# Altium project Hydra A1 UCLO 35131D.PrjPCB (part 13 of 14)

## Sheet 9.6 GHz LO Driver.SchDoc: 9.6 GHz LO Driver
size D; DrawnBy: C. Lewis; Engineer: C. Lewis; Address1: 4650 NORRIS CANYON RD.; Address2: SAN RAMON, CA 94583; DocumentNumber: 35133; Revision: D; SheetNumber: 16; SheetTotal: 20
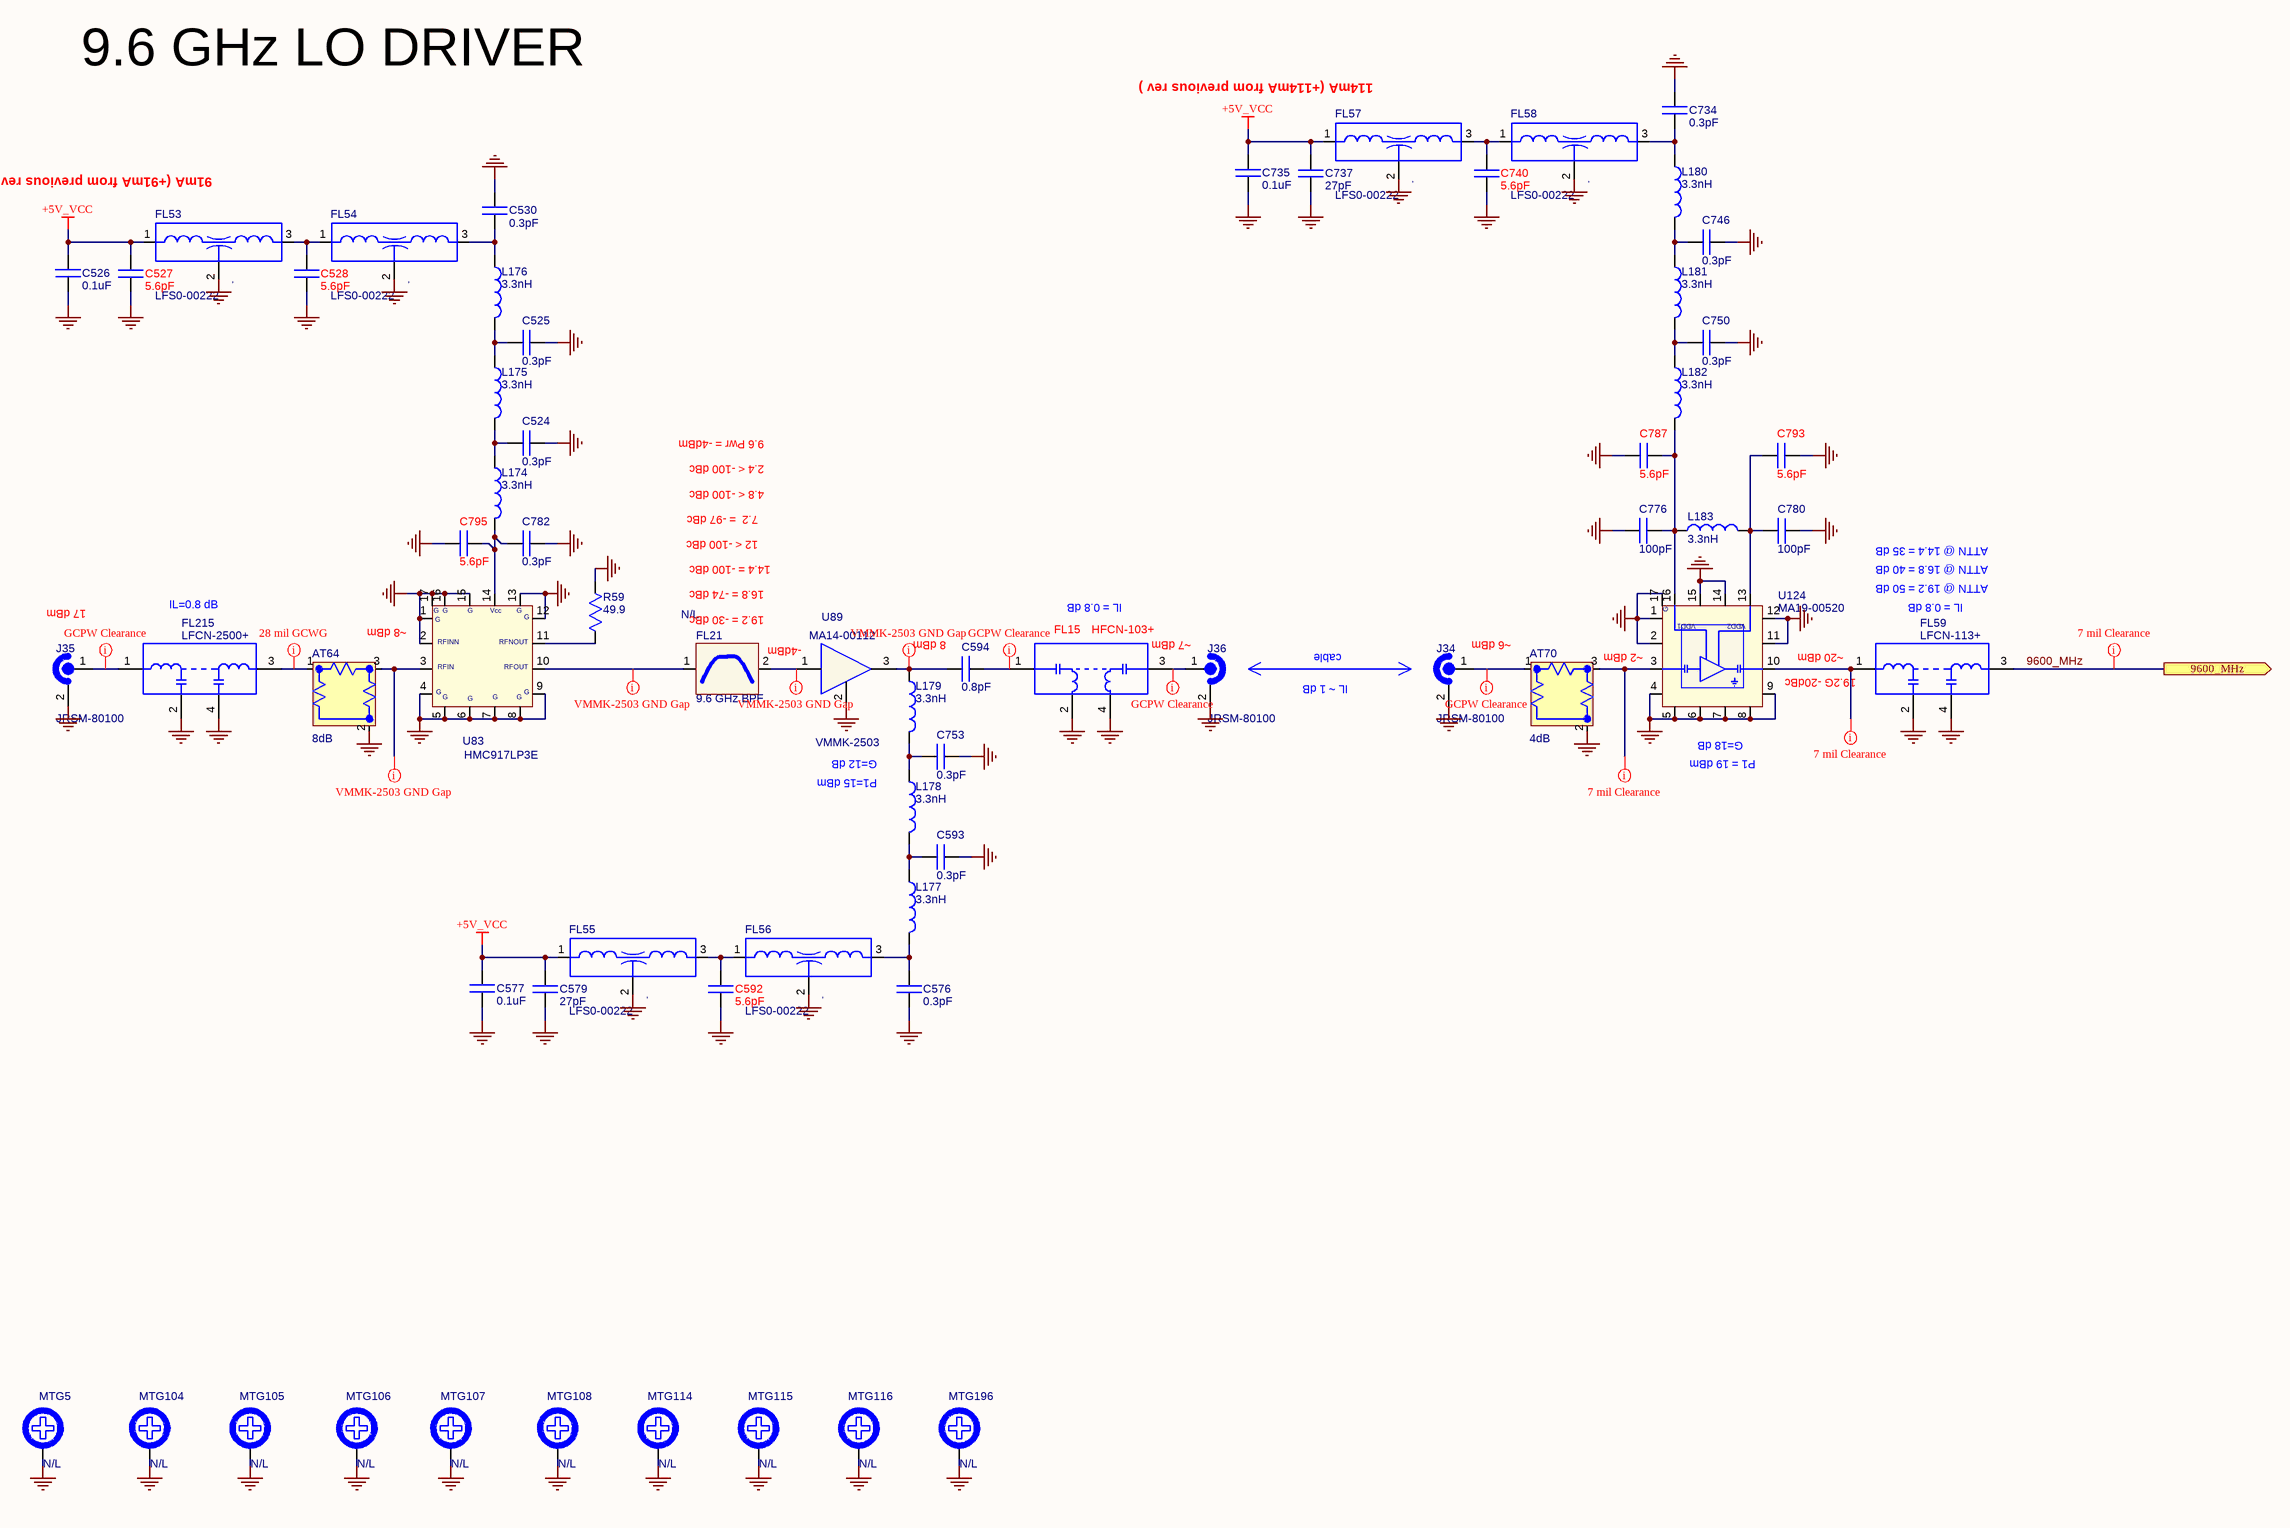
[diagram p65: 9.6 GHz LO Driver.SchDoc]

### Parts
(Parts that share a designator on the sheet are numbered #1, #2 ... from top to bottom, then left to right.)
AT64  value 8dB  [ATTN-IMS-0805]  (hidden comment: PAD;CHIP;8dB;+/-.3dB;.08 x .05;50 OHM;FACE DOWN)
AT70  value 4dB  [ATTN-IMS-0805]  (hidden comment: PAD;CHIP;4dB;+/-.3dB;.08 x .05;50 OHM;FACE DOWN)
C524  value 0.3pF  [CAP-0402-RF]  (hidden comment: .3 PF 200V .05PF HIGH Q SMT 0402)
C525  value 0.3pF  [CAP-0402-RF]  (hidden comment: .3 PF 200V .05PF HIGH Q SMT 0402)
C526  value 0.1uF  [CAP-0402-N]  (hidden comment: .1 UF,10%;X7R;16V,CHIP;0402)
C527  value 5.6pF  [CAP-0402-N]  (hidden comment: 5.6 PF;200V;.1PF;HIGH Q;SMT;CERAMIC;0402)
C528  value 5.6pF  [CAP-0402-N]  (hidden comment: 5.6 PF;200V;.1PF;HIGH Q;SMT;CERAMIC;0402)
C530  value 0.3pF  [CAP-0402-RF]  (hidden comment: .3 PF 200V .05PF HIGH Q SMT 0402)
C576  value 0.3pF  [CAP-0402-RF]  (hidden comment: .3 PF 200V .05PF HIGH Q SMT 0402)
C577  value 0.1uF  [CAP-0402-N]  (hidden comment: .1 UF,10%;X7R;16V,CHIP;0402)
C579  value 27pF  [CAP-0402-N]  (hidden comment: 27 PF;5%;COG;>50V;CHIP;0402)
C592  value 5.6pF  [CAP-0402-N]  (hidden comment: 5.6 PF;200V;.1PF;HIGH Q;SMT;CERAMIC;0402)
C593  value 0.3pF  [CAP-0402-RF]  (hidden comment: .3 PF 200V .05PF HIGH Q SMT 0402)
C594  value 0.8pF  [CAP-0402-RF]  (hidden comment: .8 PF;200V;.05PF;HIGH Q;SMT;CERAMIC;0402)
C734  value 0.3pF  [CAP-0402-RF]  (hidden comment: .3 PF 200V .05PF HIGH Q SMT 0402)
C735  value 0.1uF  [CAP-0402-N]  (hidden comment: .1 UF,10%;X7R;16V,CHIP;0402)
C737  value 27pF  [CAP-0402-N]  (hidden comment: 27 PF;5%;COG;>50V;CHIP;0402)
C740  value 5.6pF  [CAP-0402-N]  (hidden comment: 5.6 PF;200V;.1PF;HIGH Q;SMT;CERAMIC;0402)
C746  value 0.3pF  [CAP-0402-RF]  (hidden comment: .3 PF 200V .05PF HIGH Q SMT 0402)
C750  value 0.3pF  [CAP-0402-RF]  (hidden comment: .3 PF 200V .05PF HIGH Q SMT 0402)
C753  value 0.3pF  [CAP-0402-RF]  (hidden comment: .3 PF 200V .05PF HIGH Q SMT 0402)
C776  value 100pF  [CAP-0402-N]  (hidden comment: 100 PF;5%;COG;>50V;CHIP;0402)
C780  value 100pF  [CAP-0402-N]  (hidden comment: 100 PF;5%;COG;>50V;CHIP;0402)
C782  value 0.3pF  [CAP-0402-RF]  (hidden comment: .3 PF 200V .05PF HIGH Q SMT 0402)
C787  value 5.6pF  [CAP-0402-N]  (hidden comment: 5.6 PF;200V;.1PF;HIGH Q;SMT;CERAMIC;0402)
C793  value 5.6pF  [CAP-0402-N]  (hidden comment: 5.6 PF;200V;.1PF;HIGH Q;SMT;CERAMIC;0402)
C795  value 5.6pF  [CAP-0402-N]  (hidden comment: 5.6 PF;200V;.1PF;HIGH Q;SMT;CERAMIC;0402)
FL15  M_PN: HFCN-103+  [FV1206-4]  (hidden comment: FILTER;HI PASS;9700MHz;7SEC;FV1206-4;RoHS)
FL21  value 9.6 GHz BPF  NoLoad: N/L  [9.6_GHz_BPF]  (hidden comment: .)
FL53  Filter EMI 2200PF,1206  [FIL-NFE31P-1206-4P]  (value not drawn)
FL54  Filter EMI 2200PF,1206  [FIL-NFE31P-1206-4P]  (value not drawn)
FL55  Filter EMI 2200PF,1206  [FIL-NFE31P-1206-4P]  (value not drawn)
FL56  Filter EMI 2200PF,1206  [FIL-NFE31P-1206-4P]  (value not drawn)
FL57  Filter EMI 2200PF,1206  [FIL-NFE31P-1206-4P]  (value not drawn)
FL58  Filter EMI 2200PF,1206  [FIL-NFE31P-1206-4P]  (value not drawn)
FL59  M_PN: LFCN-113+  [FV1206-4]  (hidden comment: TER;LOW PASS;11.000GHZ;7 SECTIONS;.5A;FV1206-4)
FL215  M_PN: LFCN-2500+  [FV1206]  (hidden comment: FILTER;LOW PASS;2.500GHZ;5 SECTIONS;1A;1206)
J34  SMPM;FD;MALE;STRAIGHT;SMT;.152X.152X.150;PCB;R/A CONTACT  [JRSM-80100]  (value not drawn)
J35  SMPM;FD;MALE;STRAIGHT;SMT;.152X.152X.150;PCB;R/A CONTACT  [JRSM-80100]  (value not drawn)
J36  SMPM;FD;MALE;STRAIGHT;SMT;.152X.152X.150;PCB;R/A CONTACT  [JRSM-80100]  (value not drawn)
L174  value 3.3nH  [IND-0402HP]  (hidden comment: INDUCTOR;3.3NH;2%;12.8G SRF;95Q @1.7G;.045DCR;1.7A;0402)
L175  value 3.3nH  [IND-0402HP]  (hidden comment: INDUCTOR;3.3NH;2%;12.8G SRF;95Q @1.7G;.045DCR;1.7A;0402)
L176  value 3.3nH  [IND-0402HP]  (hidden comment: INDUCTOR;3.3NH;2%;12.8G SRF;95Q @1.7G;.045DCR;1.7A;0402)
L177  value 3.3nH  [IND-0402HP]  (hidden comment: INDUCTOR;3.3NH;2%;12.8G SRF;95Q @1.7G;.045DCR;1.7A;0402)
L178  value 3.3nH  [IND-0402HP]  (hidden comment: INDUCTOR;3.3NH;2%;12.8G SRF;95Q @1.7G;.045DCR;1.7A;0402)
L179  value 3.3nH  [IND-0402HP]  (hidden comment: INDUCTOR;3.3NH;2%;12.8G SRF;95Q @1.7G;.045DCR;1.7A;0402)
L180  value 3.3nH  [IND-0402HP]  (hidden comment: INDUCTOR;3.3NH;2%;12.8G SRF;95Q @1.7G;.045DCR;1.7A;0402)
L181  value 3.3nH  [IND-0402HP]  (hidden comment: INDUCTOR;3.3NH;2%;12.8G SRF;95Q @1.7G;.045DCR;1.7A;0402)
L182  value 3.3nH  [IND-0402HP]  (hidden comment: INDUCTOR;3.3NH;2%;12.8G SRF;95Q @1.7G;.045DCR;1.7A;0402)
L183  value 3.3nH  [IND-0402HP]  (hidden comment: INDUCTOR;3.3NH;2%;12.8G SRF;95Q @1.7G;.045DCR;1.7A;0402)
MTG5  NoLoad: N/L  [MHP200X92]
MTG104#2  NoLoad: N/L  [MHP200X92]
MTG105  NoLoad: N/L  [MHP200X92]
MTG106  NoLoad: N/L  [MHP200X92]
MTG107  NoLoad: N/L  [MHP200X92]
MTG108  NoLoad: N/L  [MHP200X92]
MTG114  NoLoad: N/L  [MHP200X92]
MTG115  NoLoad: N/L  [MHP200X92]
MTG116  NoLoad: N/L  [MHP200X92]
MTG196  NoLoad: N/L  [MHP200X92]
R59  value 49.9  [RES-0201-N]  (hidden comment: 49.9 OHMS;.05W;1%;200PPM;FILM CHIP;0201)
U83  M_PN: HMC917LP3E  [QFN-16_HITTITE_LP3]  (hidden comment: QUADRUPLER;1500-2500 MHZ IN;5DB CONV LOSS;0-10DBM IN;LP3E)
U89  M_PN: VMMK-2503  [AMP-VMMK-2503]  (hidden comment: AMP;1-12GHz;13.5dB;+17dBm;5V;68mA;WLP-0402)
U124  AMP;5-11GHz;21dB;+19dBm;5V;114mA;LC3  [QFN-16_HITTITE_LC3_036]  (value not drawn)

### Ports
9600_MHz

### Nets
+5V_VCC: C526.1 C527.2 C577.1 C579.2 C735.1 C737.2 FL53.1(IN) FL55.1(IN) FL57.1(IN)
GND: AT64.2(GND) AT70.2(GND) C524.1 C525.1 C526.2 C527.1 C528.1 C530.1 C576.1 C577.2 C579.1 C592.1 C593.1 C734.1 C735.2 C737.1 C740.1 C746.1 C750.1 C753.1 C776.1 C780.1 C782.1 C787.2 C793.2 C795.2 FL15.2(GND) FL15.4(GND) FL53.2(GND) FL54.2(GND) FL55.2(GND) FL56.2(GND) FL57.2(GND) FL58.2(GND) FL59.2(GND) FL59.4(GND) FL215.2(GND) FL215.4(GND) J34.2(GND) J35.2(GND) J36.2(GND) MTG5.MH MTG104#2.MH MTG105.MH MTG106.MH MTG107.MH MTG108.MH MTG114.MH MTG115.MH MTG116.MH MTG196.MH R59.2 U83.1(Vdd) U83.2(Vctl) U83.4(NC) U83.5(EN) U83.6(NC) U83.7(NC) U83.8(NC) U83.9(RF1) U83.12(RF2) U83.13(NC) U83.15(NC) U83.16(NC) U83.17(GND) U89.2(GND) U124.1(NC) U124.2(NC) U124.4(NC) U124.5(NC) U124.6(NC) U124.7(NC) U124.8(NC) U124.9(NC) U124.11(NC) U124.12(NC) U124.14(NC) U124.15(NC) U124.17(GND)
9600_MHz: FL59.3(OUT) ; port 9600_MHz
NetAT64_1: AT64.1(IN/OUT) FL215.3(OUT)
NetAT64_3: AT64.3(IN/OUT) U83.3(RFC)
NetAT70_1: AT70.1(IN/OUT) J34.1(CNTR)
NetAT70_3: AT70.3(IN/OUT) U124.3(RF_IN)
NetC524_2: C524.2 L174.2 L175.1
NetC525_2: C525.2 L175.2 L176.1
NetC528_2: C528.2 FL53.3(OUT) FL54.1(IN)
NetC530_2: C530.2 FL54.3(OUT) L176.2
NetC576_2: C576.2 FL56.3(OUT) L177.2
NetC592_2: C592.2 FL55.3(OUT) FL56.1(IN)
NetC593_2: C593.2 L177.1 L178.2
NetC594_1: C594.1 FL15.1(IN)
NetC594_2: C594.2 L179.1 U89.3(OUT)
NetC734_2: C734.2 FL58.3(OUT) L180.2
NetC740_2: C740.2 FL57.3(OUT) FL58.1(IN)
NetC746_2: C746.2 L180.1 L181.2
NetC750_2: C750.2 L181.1 L182.2
NetC753_2: C753.2 L178.1 L179.2
NetC776_2: C776.2 C787.1 L182.1 L183.2 U124.16(VDD1)
NetC780_2: C780.2 C793.1 L183.1 U124.13(VDD2)
NetC782_2: C782.2 C795.1 L174.1 U83.14(NC)
NetFL15_3: FL15.3(OUT) J36.1(CNTR)
NetFL21_1: FL21.1(IN) U83.10(GND)
NetFL21_2: FL21.2(OUT) U89.1(IN)
NetFL59_1: FL59.1(IN) U124.10(RF_OUT)
NetFL215_1: FL215.1(IN) J35.1(CNTR)
NetR59_1: R59.1 U83.11(GND)

### Layout directives
net class GCPW Clearance: NetAT70_1, NetC594_1, NetFL15_3, NetFL215_1
net class 7 mil Clearance: 9600_MHz, NetAT70_3, NetFL59_1
net class VMMK-2503 GND Gap: NetAT64_3, NetC594_2, NetFL21_1, NetFL21_2
net class 28 mil GCWG: NetAT64_1

### Notes on the sheet
- 9.6 GHz LO DRIVER
- 114mA (+114mA from previous rev )
- 91mA (+91mA from previous rev )
- 9.6 Pwr = -4dBm
- 2.4 < -100 dBc
- 7.2  = -97 dBc
- 12 < -100 dBc
- 4.8 < -100 dBc
- ATTN @ 14.4 = 35 dB
- 17 dBm
- 16.8 = -74 dBc
- 14.4 = -100 dBc
- IL = 0.8 dB
- ATTN @ 16.8 = 40 dB
- ATTN @ 19.2 = 50 dB
- IL=0.8 dB
- ~8 dBm
- (near FL21) 19.2 = -30 dBc
- -4dBm
- 8 dBm
- ~7 dBm
- cable
- ~6 dBm
- ~2 dBm
- ~20 dBm
- 19.2G -20dBc
- IL ~ 1 dB
- G=12 dB
- (near L178) P1=15 dBm
- (near U124) G=18 dB
- P1 = 19 dBm
- Title
- Sheet Title
- PRINTED DOCUMENT IS CONSIDERED UNCONTROLLED. VERIFY REVISION IN PLM SYSTEM.
- THIS DOCUMENT CONTAINS PROPRIETARY INFORMATION. DESIGN RIGHTS BELONG TO GIGA-TRONICS AND MAY NOT BE REPRODUCED WITHOUT WRITTEN AUTHORIZATION FOR ANY REASON EXCEPT CALIBRATION, OPERATION AND MAINTENANCE.
- Size
- CAGE CODE
- Filename
- D
- Document Number
- 58900
- Date
- Sheet
- Rev
- of
- (in symbol LFS0-00222) ,
- (in symbol MA19-00520) G
- (in symbol MX04-00305) G; Vcc; RFINN; RFNOUT; RFIN; RFOUT

### Library data of the parts
AT64 = MPFC-A1008: NoLoad: .; Approved: CL; M_PN: IMS1141-08DB; MFGR: IMS RESISTORS; level: 1; line_number: 38; ModifyDate: 4/23/13; G_PN: MPFC-A1008; item_number: MPFC-A1008
AT70 = MPFC-A1004: NoLoad: .; Approved: CL; M_PN: IMS1141-04DB; MFGR: IMS RESISTORS; level: 1; line_number: 30; ModifyDate: 3/8/13; G_PN: MPFC-A1004; item_number: MPFC-A1004
C524 C525 C530 C576 C593 C734 C746 C750 C753 C782 = CK41-00003: Approved: CL; NoLoad: .; M_PN: 600L0R3AT200T; MFGR: ATC; level: 1; line_number: 140; G_PN: CK41-00003; ModifyDate: 01/23/14; item_number: CK41-00003
C526 C577 C735 = CK40-04100: Approved: CL; NoLoad: .; M_PN: C0402X7R160-104KNP; MFGR: VENKEL; level: 1; line_number: 95; ModifyDate: 3/29/13; G_PN: CK40-04100; item_number: CK40-04100
C527 C528 C592 C740 = CK41-00056: MFGR: ATC; M_PN: 600L5R6BT200; Approved: CL; NoLoad: .; level: 1; line_number: 120; ModifyDate: 3/11/13; G_PN: CK41-00056; item_number: CK41-00056
C579 C737 = CK40-00270: MFGR: ANY; Approved: CL; NoLoad: .; level: 1; line_number: 215; ModifyDate: 02/22/12; M_PN: ANY; G_PN: CK40-00270; item_number: CK40-00270
C594 = CK41-00008: Approved: CL; NoLoad: .; M_PN: 600L0R8AT200; MFGR: ATC; level: 1; line_number: 230; G_PN: CK41-00008; ModifyDate: 02/22/12; item_number: CK41-00008
C776 C780 = CK40-01100: Approved: CL; NoLoad: .; M_PN: Any; level: 1; line_number: 70; G_PN: CK40-01100; ModifyDate: 3/21/12; MFGR: Any; item_number: CK40-01100
C787 C793 C795 = CK41-00056: Approved: CL; NoLoad: .; M_PN: 600L5R6BT200; MFGR: ATC; level: 1; line_number: 120; ModifyDate: 3/11/13; G_PN: CK41-00056; item_number: CK41-00056
FL15 = MFH0-09700: MFGR: MINI-CIRCUITS; Approved: CL; Value: HFCN-103+; NoLoad: .; level: 1; line_number: 342; G_PN: MFH0-09700; ModifyDate: 1/22/15; item_number: MFH0-09700
FL21 = 9.6 GHz BPF: Approved: CL; level: 1; ModifyDate: 6/2/13
FL53-FL58 = LFS0-00222: Approved: CL; NoLoad: .; M_PN: NFE31PT222Z1E9BL; MFGR: MURATA; level: 1; line_number: 335; G_PN: LFS0-00222; ModifyDate: 02/22/12; Value: 2200pF; item_number: LFS0-00222
FL59 = MFL0-11000: MFGR: MINI-CIRCUITS; Approved: CL; Value: LFCN-113+; NoLoad: .; level: 1; line_number: 395; G_PN: MFL0-11000; ModifyDate: 3/14/13; item_number: MFL0-11000
FL215 = MFL0-02500: MFGR: MINI-CIRCUITS; Approved: CL; Value: LFCN-2500+; NoLoad: .; level: 1; line_number: 460; G_PN: MFL0-02500; ModifyDate: 3/5/13; item_number: MFL0-02500
J34-J36 = JRSM-80100: Value: B012-P93-01; MFGR: Corning Gilbert; Approved: CL; NoLoad: .; level: 1; line_number: 486; M_PN: B012-P93-01; ModifyDate: 10/15/14; G_PN: JRSM-80100; item_number: JRSM-80100
L174-L183 = LSA6-02330: M_PN: 0402HP-3N3XGLU; MFGR: COILCRAFT; NoLoad: .; Approved: CL; level: 1; line_number: 527; G_PN: LSA6-02330; ModifyDate: 12/4/14; item_number: LSA6-02330
MTG5 MTG104#2 MTG105-MTG108 MTG114-MTG116 MTG196 = MHP200X92: level: 1; ModifyDate: 02/14/2008 14:07:19; Value: *
R59 = RK30-00499: Approved: CL; NoLoad: .; MFGR: Vishay-Dale; M_PN: CRCW020149R9FNED; level: 1; line_number: 970; G_PN: RK30-00499; ModifyDate: 2-11-14; item_number: RK30-00499
U83 = MX04-00305: MFGR: HITTITE; Approved: CL; Value: HMC917LP3E; NoLoad: .; level: 1; line_number: 1318; ModifyDate: 11.22/13; G_PN: MX04-00305; item_number: MX04-00305
U89 = MA14-00112: NoLoad: .; Approved: NM; MFGR: AVAGO; level: 1; line_number: 1340; ModifyDate: 11/28/12; G_PN: MA14-00112; item_number: MA14-00112
U124 = MA19-00520: NoLoad: .; Approved: CL; MFGR: HITTITE; Value: HMC451LC3; level: 1; line_number: 1323; ModifyDate: 1/25/13; M_PN: HMC451LC3; G_PN: MA19-00520; item_number: MA19-00520

## Sheet Modulation.SchDoc: Modulation
size D; Date: 09-24-10; DrawnBy: C. Lewis; Engineer: C. Lewis; Address1: 4650 NORRIS CANYON RD.; Address2: SAN RAMON, CA 94583; DocumentNumber: 35133; Revision: D; SheetNumber: 15; SheetTotal: 20; PageSetup: Record=PageOptions|CenterHorizontal=False|CenterVertical=False|PrintScale=0.50|XCorrection=1.00|YCorrection=1.00|PrintKind=0|BorderSize=5000000|LeftOffset=0|BottomOffset=0|Orientation=2|PaperLength=1000|PaperWidth=1000|Scale=100|PaperSource=15|PrintQuality=600|MediaType=1|DitherType=10|PrintScaleMode=0|PaperKind=11x17|PaperIndex=1; DocumentName: Sheet1.SCHDOC; ModifiedDate: 10-27-11
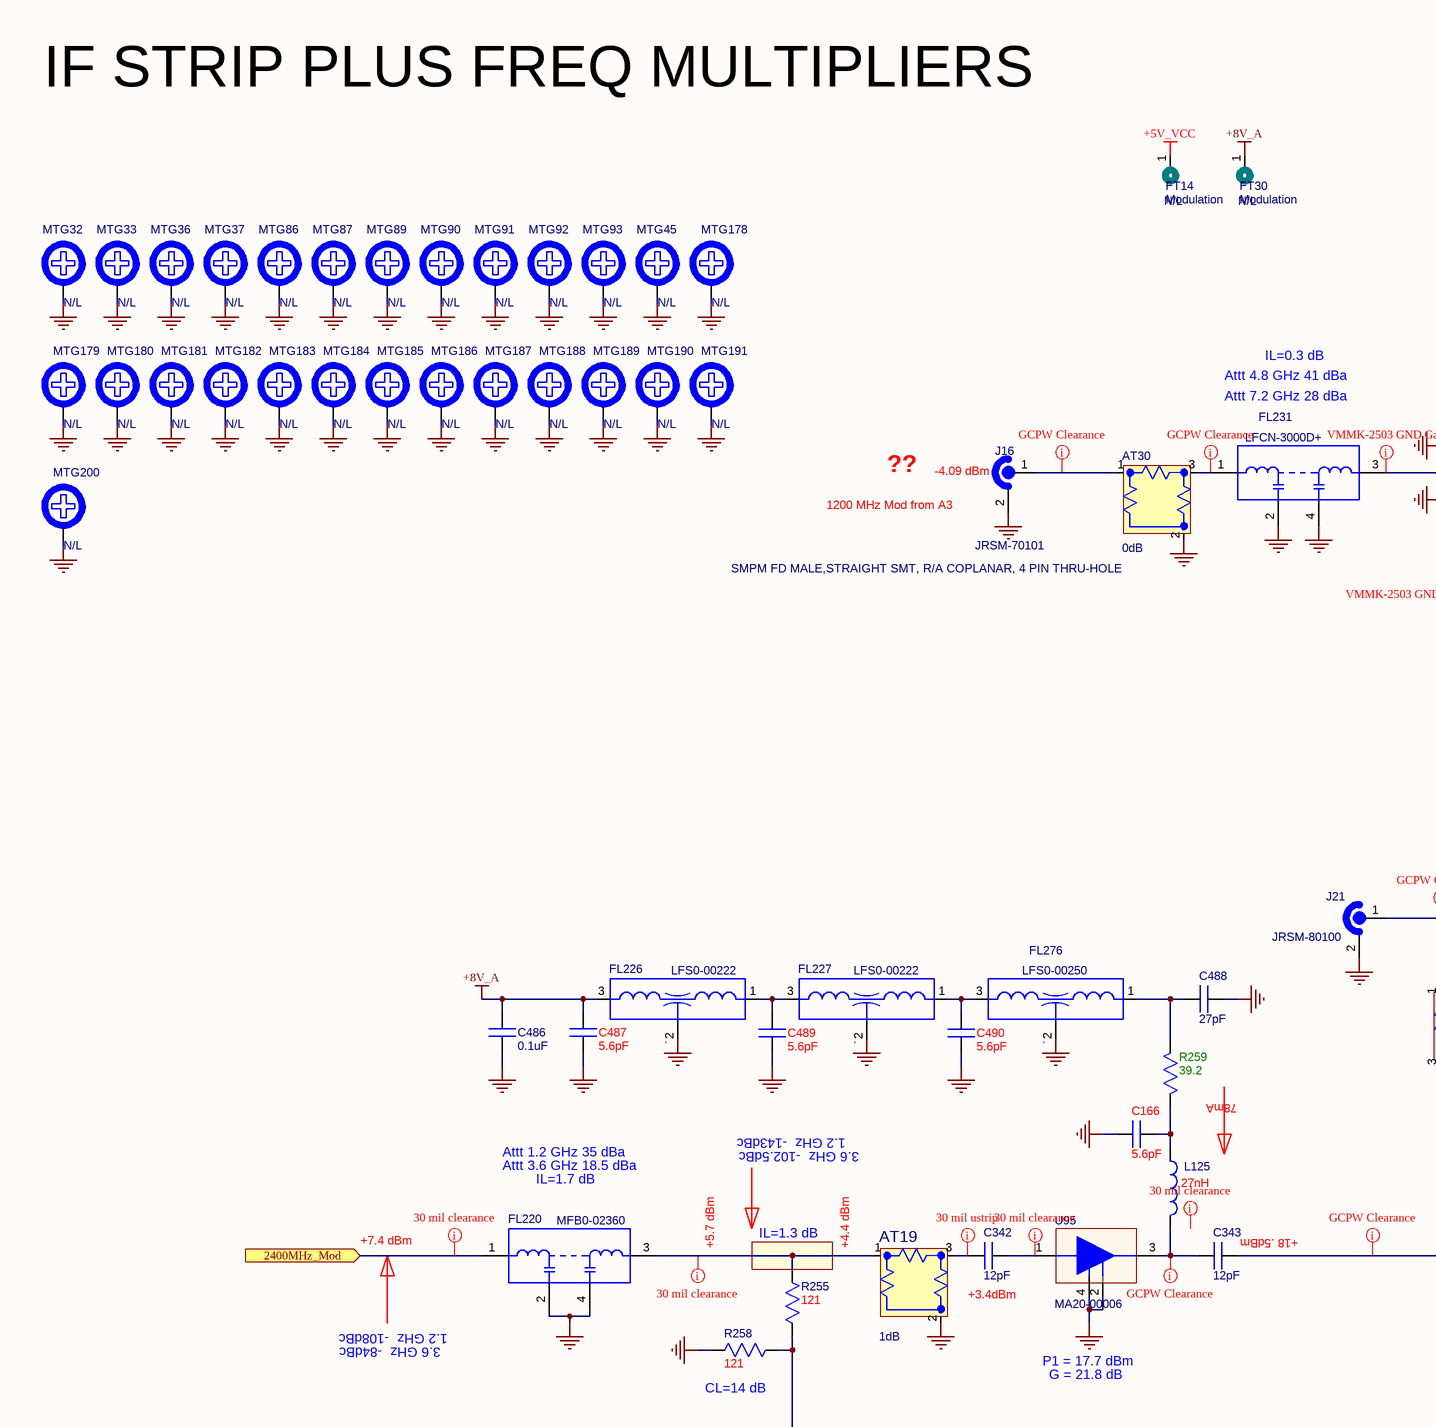
[diagram p66: Modulation.SchDoc, top left]
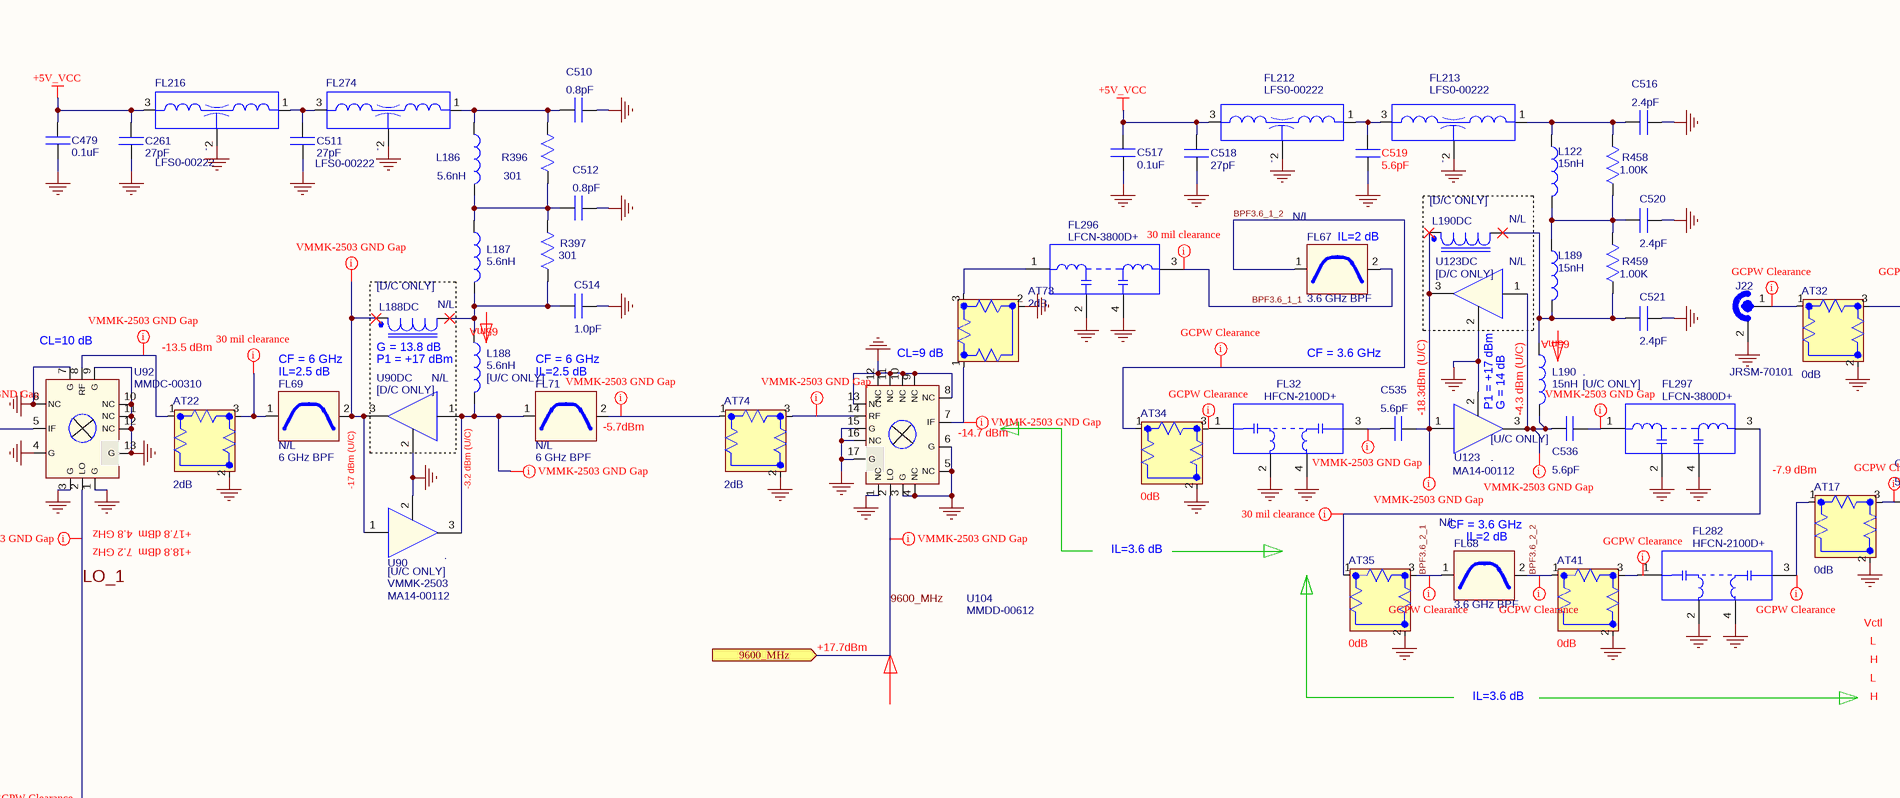
[diagram p67: Modulation.SchDoc, top middle]
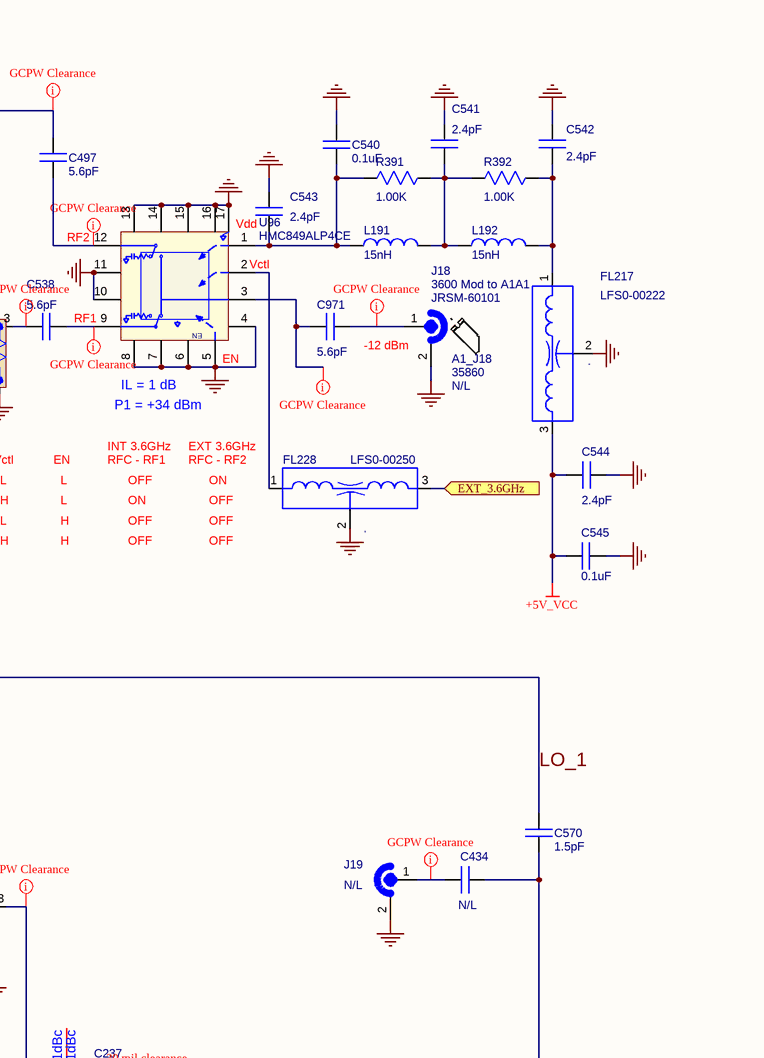
[diagram p68: Modulation.SchDoc, top right]
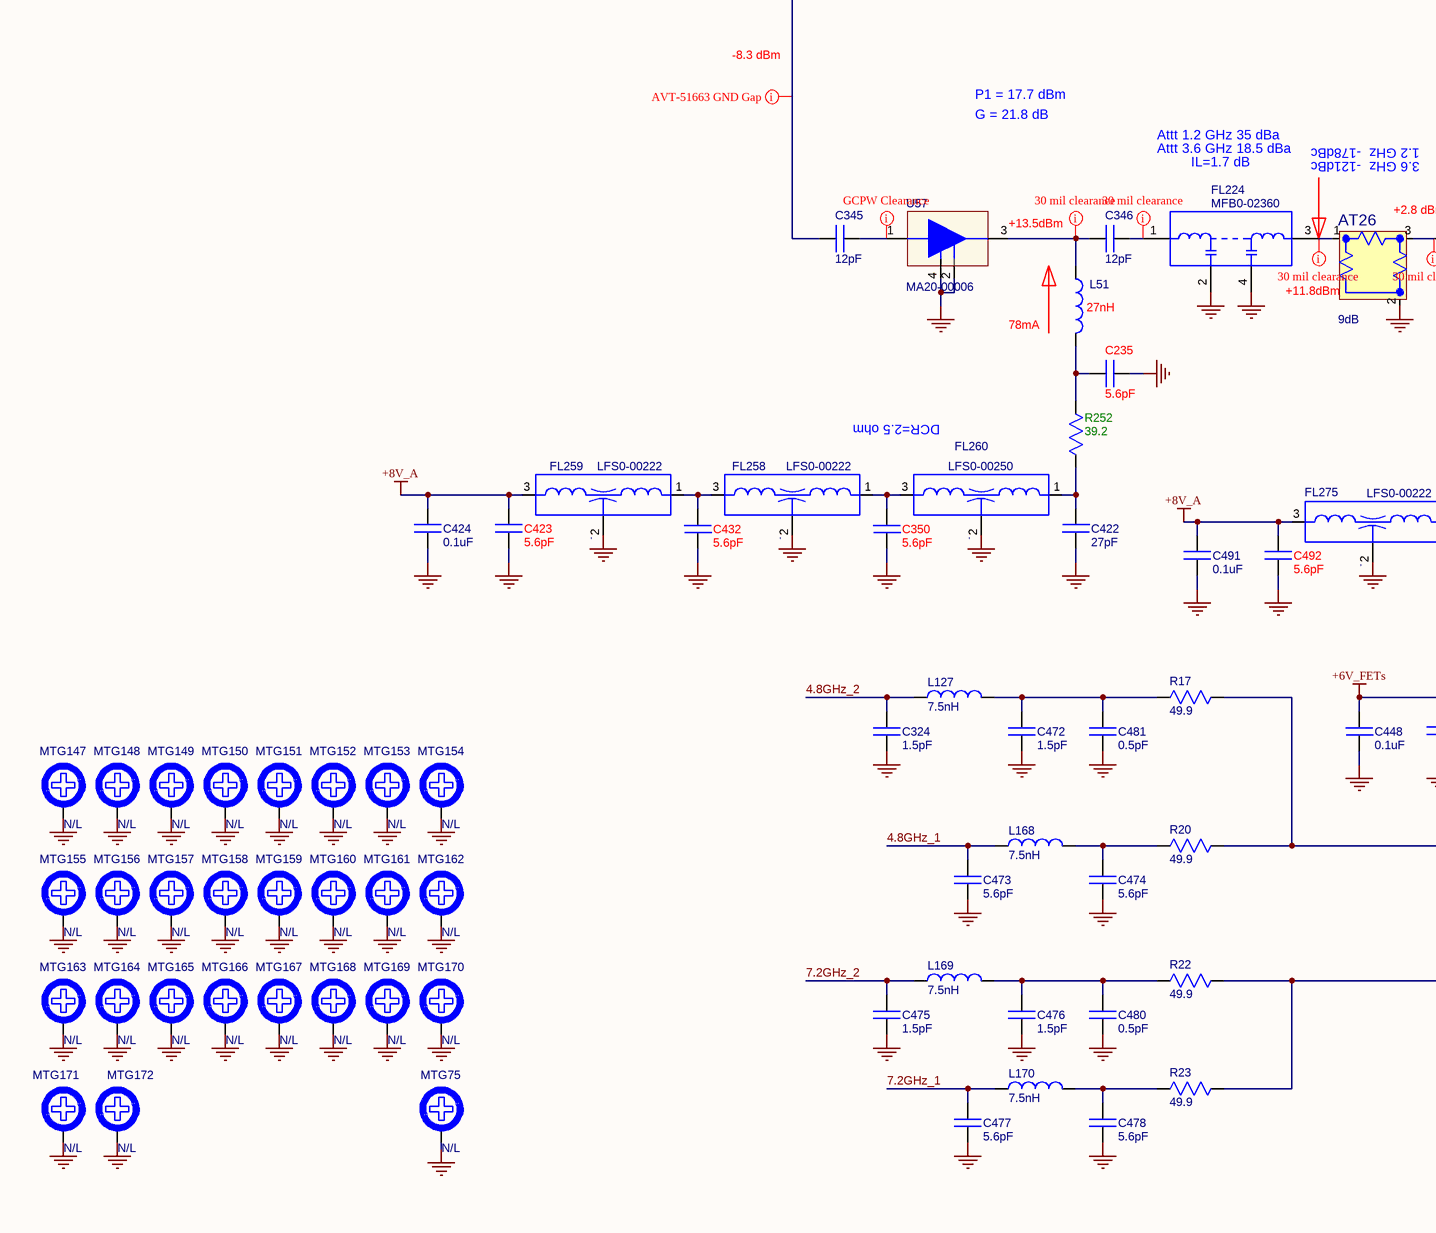
[diagram p69: Modulation.SchDoc, bottom left]
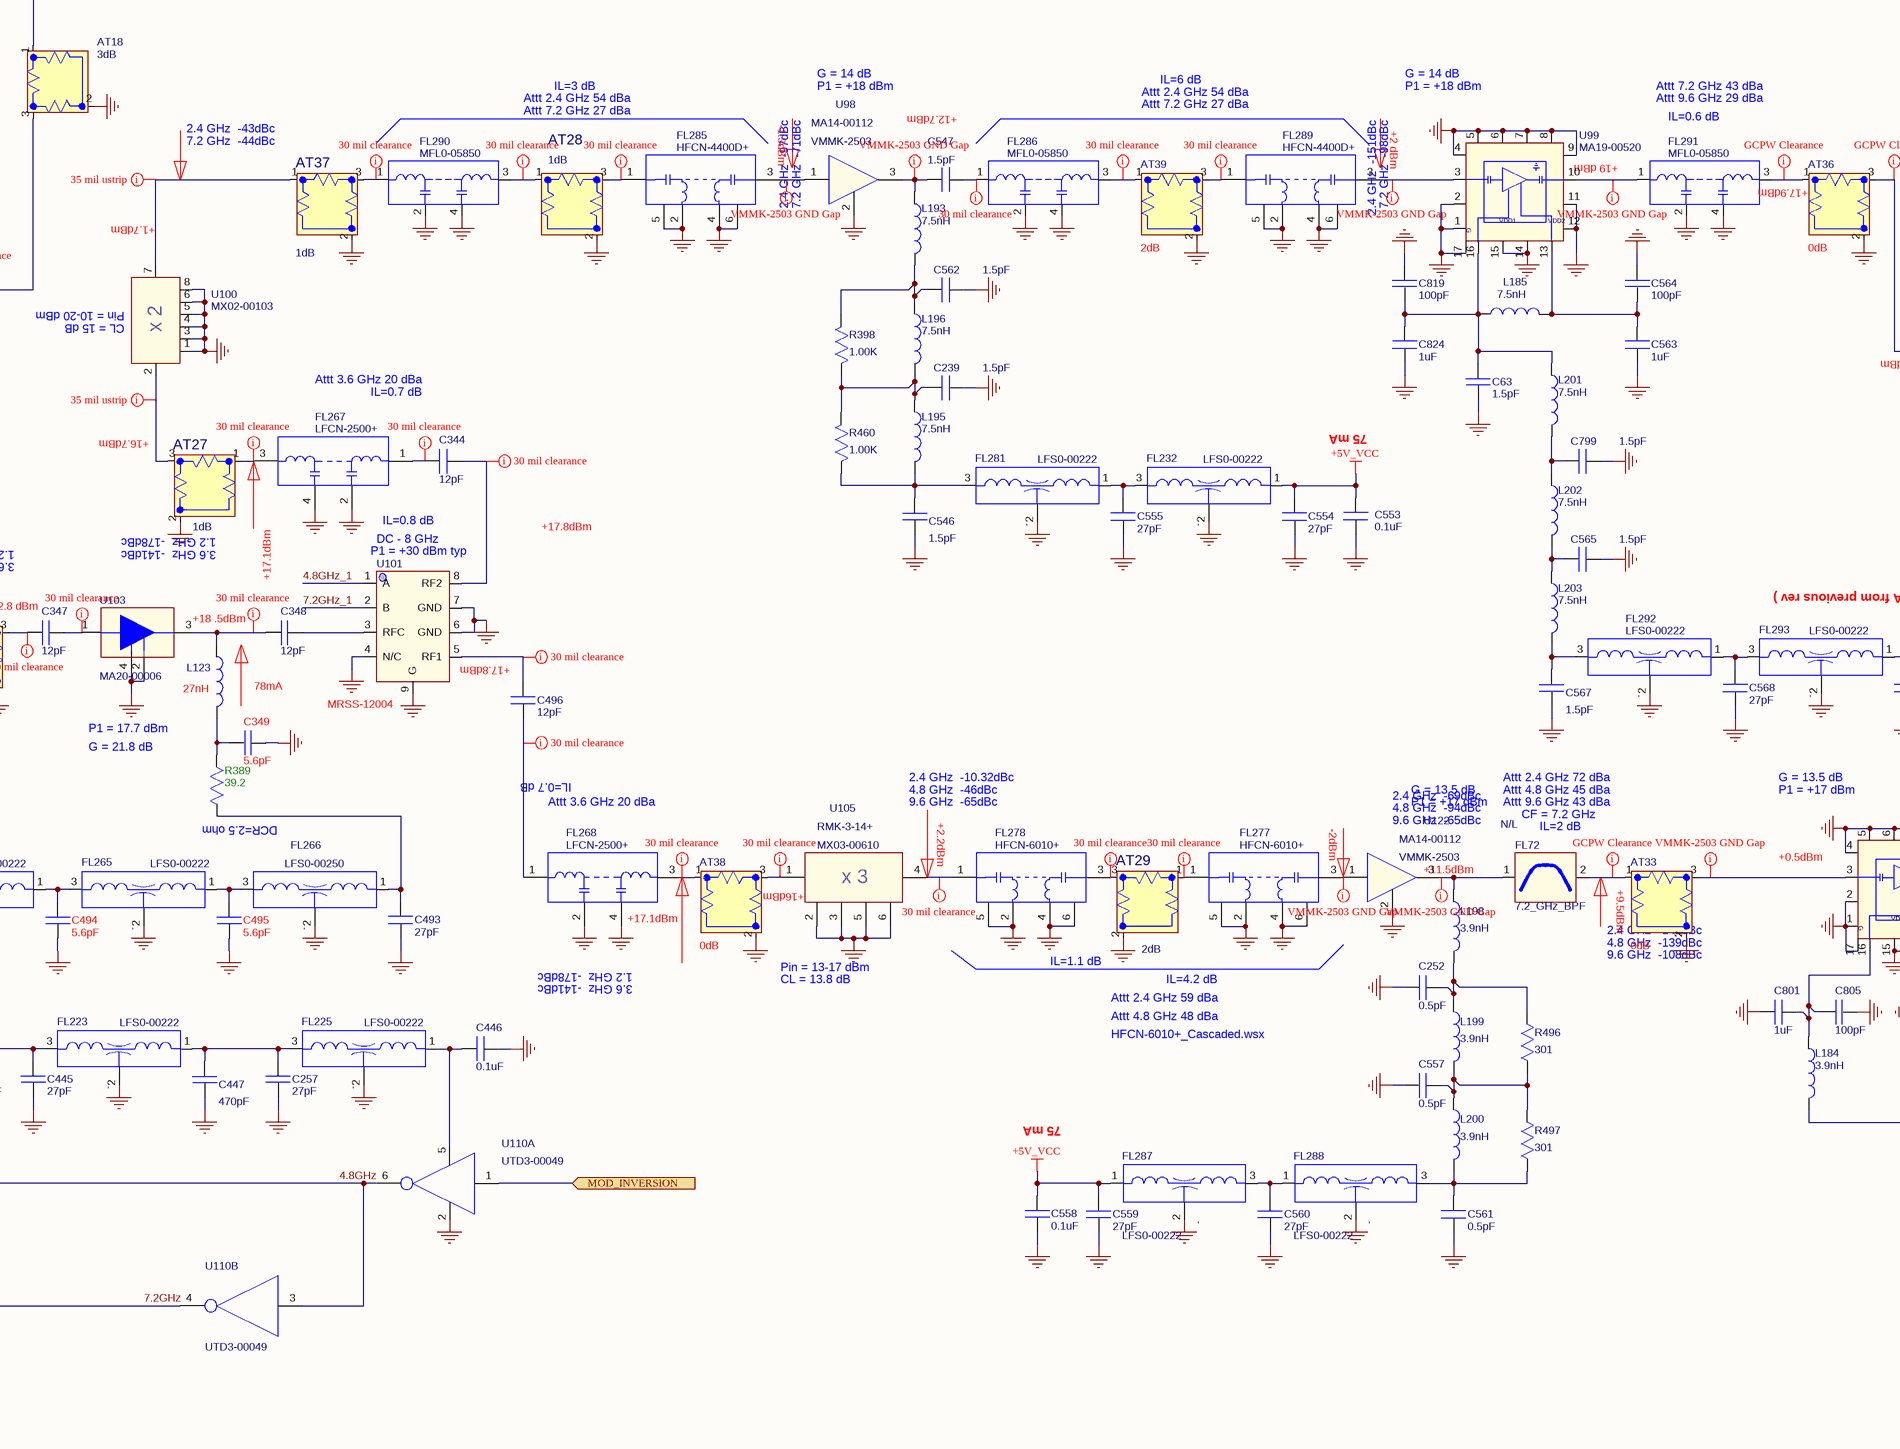
[diagram p70: Modulation.SchDoc, bottom middle]
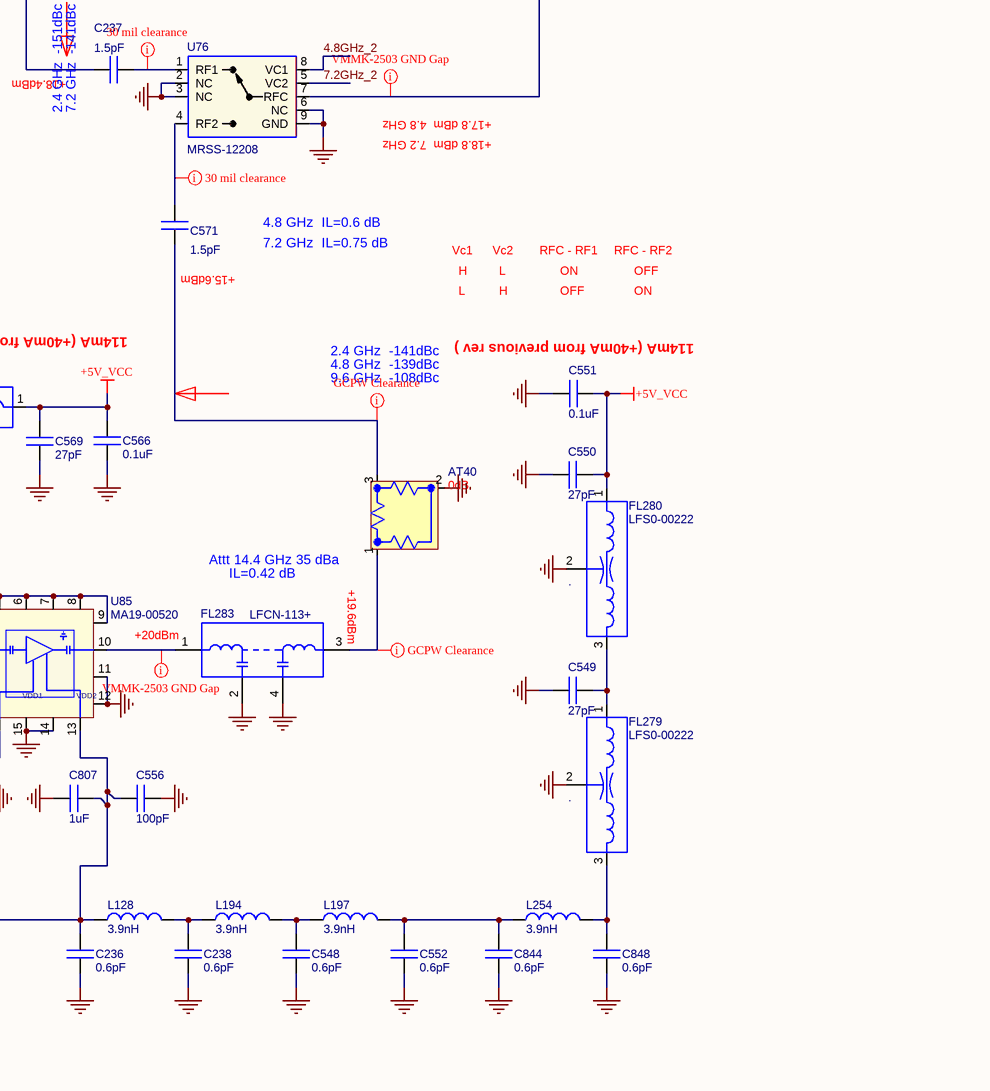
[diagram p71: Modulation.SchDoc, bottom right]

### Parts
A1_J18  NoLoad: N/L  [35860]  (hidden comment: 35860)
AT17  value 0dB  [ATTN-IMS-0805]  (hidden comment: PAD;CHIP;0dB;+/-.3dB;.08 x .05;50 OHM;FACE DOWN)
AT18  value 3dB  [ATTN-IMS-0805]  (hidden comment: PAD;CHIP;3dB;+/-.3dB;.08 x .05;50 OHM;FACE DOWN)
AT19  value 1dB  [ATTN-IMS-0805]  (hidden comment: PAD;CHIP;1dB;+/-.3dB;.08 x .05;50 OHM;FACE DOWN)
AT22  value 2dB  [ATTN-IMS-0805]  (hidden comment: PAD;CHIP;2dB;+/-.3dB;.08 x .05;50 OHM;FACE DOWN)
AT26  value 9dB  [ATTN-IMS-0805]  (hidden comment: PAD;CHIP;9dB;+/-.3dB;.08 x .05;50 OHM;FACE DOWN)
AT27  value 1dB  [ATTN-IMS-0805]  (hidden comment: PAD;CHIP;1dB;+/-.3dB;.08 x .05;50 OHM;FACE DOWN)
AT28  value 1dB  [ATTN-IMS-0805]  (hidden comment: PAD;CHIP;1dB;+/-.3dB;.08 x .05;50 OHM;FACE DOWN)
AT29  value 2dB  [ATTN-IMS-0805]  (hidden comment: PAD;CHIP;2dB;+/-.3dB;.08 x .05;50 OHM;FACE DOWN)
AT30  value 0dB  [ATTN-IMS-0805]  (hidden comment: PAD;CHIP;0dB;+/-.3dB;.08 x .05;50 OHM;FACE DOWN)
AT32  value 0dB  [ATTN-IMS-0805]  (hidden comment: PAD;CHIP;0dB;+/-.3dB;.08 x .05;50 OHM;FACE DOWN)
AT33  value 0dB  [ATTN-IMS-0805]  (hidden comment: PAD;CHIP;0dB;+/-.3dB;.08 x .05;50 OHM;FACE DOWN)
AT34  value 0dB  [ATTN-IMS-0805]  (hidden comment: PAD;CHIP;0dB;+/-.3dB;.08 x .05;50 OHM;FACE DOWN)
AT35  value 0dB  [ATTN-IMS-0805]  (hidden comment: PAD;CHIP;0dB;+/-.3dB;.08 x .05;50 OHM;FACE DOWN)
AT36  value 0dB  [ATTN-IMS-0805]  (hidden comment: PAD;CHIP;0dB;+/-.3dB;.08 x .05;50 OHM;FACE DOWN)
AT37  value 1dB  [ATTN-IMS-0805]  (hidden comment: PAD;CHIP;1dB;+/-.3dB;.08 x .05;50 OHM;FACE DOWN)
AT38  value 0dB  [ATTN-IMS-0805]  (hidden comment: PAD;CHIP;0dB;+/-.3dB;.08 x .05;50 OHM;FACE DOWN)
AT39  value 2dB  [ATTN-IMS-0805]  (hidden comment: PAD;CHIP;2dB;+/-.3dB;.08 x .05;50 OHM;FACE DOWN)
AT40  value 0dB  [ATTN-IMS-0805]  (hidden comment: PAD;CHIP;0dB;+/-.3dB;.08 x .05;50 OHM;FACE DOWN)
AT41  value 0dB  [ATTN-IMS-0805]  (hidden comment: PAD;CHIP;0dB;+/-.3dB;.08 x .05;50 OHM;FACE DOWN)
AT73  value 2dB  [ATTN-IMS-0603]  (hidden comment: PAD;CHIP;2dB;.06 x .03;50 OHM;FACE DOWN)
AT74  value 2dB  [ATTN-IMS-0603_SHORTENED]  (hidden comment: PAD;CHIP;2dB;.06 x .03;50 OHM;FACE DOWN)
C63  value 1.5pF  [CAP-0402-RF]  (hidden comment: 1.5 PF;200V;.05PF;HIGH Q;SMT;CERAMIC;0402)
C166  value 5.6pF  [CAP-0402-N]  (hidden comment: 5.6 PF;200V;.1PF;HIGH Q;SMT;CERAMIC;0402)
C235  value 5.6pF  [CAP-0402-N]  (hidden comment: 5.6 PF;200V;.1PF;HIGH Q;SMT;CERAMIC;0402)
C236  value 0.6pF  [CAP-0402-RF]  (hidden comment: .6 PF;200V;.05PF;HIGH Q;SMT;CERAMIC;0402)
C237  value 1.5pF  [CAP-0402-RF]  (hidden comment: 1.5 PF;200V;.05PF;HIGH Q;SMT;CERAMIC;0402)
C238  value 0.6pF  [CAP-0402-RF]  (hidden comment: .6 PF;200V;.05PF;HIGH Q;SMT;CERAMIC;0402)
C239  value 1.5pF  [CAP-0402-RF]  (hidden comment: 1.5 PF;200V;.05PF;HIGH Q;SMT;CERAMIC;0402)
C252  value 0.5pF  [CAP-0402-RF]  (hidden comment: .5 PF;200V;.05PF;HIGH Q;SMT;CERAMIC;0402)
C257  value 27pF  [CAP-0402-N]  (hidden comment: 27 PF;5%;COG;>50V;CHIP;0402)
C261  value 27pF  [CAP-0402-N]  (hidden comment: 27 PF;5%;COG;>50V;CHIP;0402)
C324  value 1.5pF  [CAP-0402-RF]  (hidden comment: 1.5 PF;200V;.05PF;HIGH Q;SMT;CERAMIC;0402)
C342  value 12pF  [CAP-0402-N]  (hidden comment: 12 PF;5%;COG;>50V;CHIP;0402)
C343  value 12pF  [CAP-0402-N]  (hidden comment: 12 PF;5%;COG;>50V;CHIP;0402)
C344  value 12pF  [CAP-0402-N]  (hidden comment: 12 PF;5%;COG;>50V;CHIP;0402)
C345  value 12pF  [CAP-0402-N]  (hidden comment: 12 PF;5%;COG;>50V;CHIP;0402)
C346  value 12pF  [CAP-0402-N]  (hidden comment: 12 PF;5%;COG;>50V;CHIP;0402)
C347  value 12pF  [CAP-0402-N]  (hidden comment: 12 PF;5%;COG;>50V;CHIP;0402)
C348  value 12pF  [CAP-0402-N]  (hidden comment: 12 PF;5%;COG;>50V;CHIP;0402)
C349  value 5.6pF  [CAP-0402-N]  (hidden comment: 5.6 PF;200V;.1PF;HIGH Q;SMT;CERAMIC;0402)
C350  value 5.6pF  [CAP-0402-N]  (hidden comment: 5.6 PF;200V;.1PF;HIGH Q;SMT;CERAMIC;0402)
C422  value 27pF  [CAP-0402-N]  (hidden comment: 27 PF;5%;COG;>50V;CHIP;0402)
C423  value 5.6pF  [CAP-0402-N]  (hidden comment: 5.6 PF;200V;.1PF;HIGH Q;SMT;CERAMIC;0402)
C424  value 0.1uF  [CAP-0402-N]  (hidden comment: .1 UF,10%;X7R;16V,CHIP;0402)
C432  value 5.6pF  [CAP-0402-N]  (hidden comment: 5.6 PF;200V;.1PF;HIGH Q;SMT;CERAMIC;0402)
C434  NoLoad: N/L  [CAP-0402-RF]  (hidden comment: 1.5 PF;200V;.05PF;HIGH Q;SMT;CERAMIC;0402)
C445  value 27pF  [CAP-0402-N]  (hidden comment: 27 PF;5%;COG;>50V;CHIP;0402)
C446  value 0.1uF  [CAP-0402-N]  (hidden comment: .1 UF,10%;X7R;16V,CHIP;0402)
C447  value 470pF  [CAP-0402-N]  (hidden comment: 470 PF;5%;COG;>50V;CHIP;0402)
C448  value 0.1uF  [CAP-0402-N]  (hidden comment: .1 UF,10%;X7R;16V,CHIP;0402)
C472  value 1.5pF  [CAP-0402-RF]  (hidden comment: 1.5 PF;200V;.05PF;HIGH Q;SMT;CERAMIC;0402)
C473  value 5.6pF  [CAP-0402-RF]  (hidden comment: 5.6 PF;200V;.1PF;HIGH Q;SMT;CERAMIC;0402)
C474  value 5.6pF  [CAP-0402-RF]  (hidden comment: 5.6 PF;200V;.1PF;HIGH Q;SMT;CERAMIC;0402)
C475  value 1.5pF  [CAP-0402-RF]  (hidden comment: 1.5 PF;200V;.05PF;HIGH Q;SMT;CERAMIC;0402)
C476  value 1.5pF  [CAP-0402-RF]  (hidden comment: 1.5 PF;200V;.05PF;HIGH Q;SMT;CERAMIC;0402)
C477  value 5.6pF  [CAP-0402-RF]  (hidden comment: 5.6 PF;200V;.1PF;HIGH Q;SMT;CERAMIC;0402)
C478  value 5.6pF  [CAP-0402-RF]  (hidden comment: 5.6 PF;200V;.1PF;HIGH Q;SMT;CERAMIC;0402)
C479  value 0.1uF  [CAP-0402-N]  (hidden comment: .1 UF,10%;X7R;16V,CHIP;0402)
C480  value 0.5pF  [CAP-0402-RF]  (hidden comment: .5 PF;200V;.05PF;HIGH Q;SMT;CERAMIC;0402)
C481  value 0.5pF  [CAP-0402-RF]  (hidden comment: .5 PF;200V;.05PF;HIGH Q;SMT;CERAMIC;0402)
C486  value 0.1uF  [CAP-0402-N]  (hidden comment: .1 UF,10%;X7R;16V,CHIP;0402)
C487  value 5.6pF  [CAP-0402-N]  (hidden comment: 5.6 PF;200V;.1PF;HIGH Q;SMT;CERAMIC;0402)
C488  value 27pF  [CAP-0402-N]  (hidden comment: 27 PF;5%;COG;>50V;CHIP;0402)
C489  value 5.6pF  [CAP-0402-N]  (hidden comment: 5.6 PF;200V;.1PF;HIGH Q;SMT;CERAMIC;0402)
C490  value 5.6pF  [CAP-0402-N]  (hidden comment: 5.6 PF;200V;.1PF;HIGH Q;SMT;CERAMIC;0402)
C491  value 0.1uF  [CAP-0402-N]  (hidden comment: .1 UF,10%;X7R;16V,CHIP;0402)
C492  value 5.6pF  [CAP-0402-N]  (hidden comment: 5.6 PF;200V;.1PF;HIGH Q;SMT;CERAMIC;0402)
C493  value 27pF  [CAP-0402-N]  (hidden comment: 27 PF;5%;COG;>50V;CHIP;0402)
C494  value 5.6pF  [CAP-0402-N]  (hidden comment: 5.6 PF;200V;.1PF;HIGH Q;SMT;CERAMIC;0402)
C495  value 5.6pF  [CAP-0402-N]  (hidden comment: 5.6 PF;200V;.1PF;HIGH Q;SMT;CERAMIC;0402)
C496  value 12pF  [CAP-0402-N]  (hidden comment: 12 PF;5%;COG;>50V;CHIP;0402)
C497  value 5.6pF  [CAP-0402-RF]  (hidden comment: 5.6 PF;200V;.1PF;HIGH Q;SMT;CERAMIC;0402)
C510  value 0.8pF  [CAP-0402-RF]  (hidden comment: .8 PF;200V;.05PF;HIGH Q;SMT;CERAMIC;0402)
C511  value 27pF  [CAP-0402-N]  (hidden comment: 27 PF;5%;COG;>50V;CHIP;0402)
C512  value 0.8pF  [CAP-0402-RF]  (hidden comment: .8 PF;200V;.05PF;HIGH Q;SMT;CERAMIC;0402)
C514  value 1.0pF  [CAP-0402-RF]  (hidden comment: 1.0 PF;200V;.05PF;HIGH Q;SMT;CERAMIC;0402)
C516  value 2.4pF  [CAP-0402-RF]  (hidden comment: 2.4 PF;200V;.05PF;HIGH Q;SMT;CERAMIC;0402)
C517  value 0.1uF  [CAP-0402-N]  (hidden comment: .1 UF,10%;X7R;16V,CHIP;0402)
C518  value 27pF  [CAP-0402-N]  (hidden comment: 27 PF;5%;COG;>50V;CHIP;0402)
C519  value 5.6pF  [CAP-0402-N]  (hidden comment: 5.6 PF;200V;.1PF;HIGH Q;SMT;CERAMIC;0402)
C520  value 2.4pF  [CAP-0402-RF]  (hidden comment: 2.4 PF;200V;.05PF;HIGH Q;SMT;CERAMIC;0402)
C521  value 2.4pF  [CAP-0402-RF]  (hidden comment: 2.4 PF;200V;.05PF;HIGH Q;SMT;CERAMIC;0402)
C535  value 5.6pF  [CAP-0402-RF]  (hidden comment: 5.6 PF;200V;.1PF;HIGH Q;SMT;CERAMIC;0402)
C536  value 5.6pF  [CAP-0402-RF]  (hidden comment: 5.6 PF;200V;.1PF;HIGH Q;SMT;CERAMIC;0402)
C538  value 5.6pF  [CAP-0402-RF]  (hidden comment: 5.6 PF;200V;.1PF;HIGH Q;SMT;CERAMIC;0402)
C540  value 0.1uF  [CAP-0402-N]  (hidden comment: .1 UF,10%;X7R;16V,CHIP;0402)
C541  value 2.4pF  [CAP-0402-RF]  (hidden comment: 2.4 PF;200V;.05PF;HIGH Q;SMT;CERAMIC;0402)
C542  value 2.4pF  [CAP-0402-RF]  (hidden comment: 2.4 PF;200V;.05PF;HIGH Q;SMT;CERAMIC;0402)
C543  value 2.4pF  [CAP-0402-RF]  (hidden comment: 2.4 PF;200V;.05PF;HIGH Q;SMT;CERAMIC;0402)
C544  value 2.4pF  [CAP-0402-RF]  (hidden comment: 2.4 PF;200V;.05PF;HIGH Q;SMT;CERAMIC;0402)
C545  value 0.1uF  [CAP-0402-N]  (hidden comment: .1 UF,10%;X7R;16V,CHIP;0402)
C546  value 1.5pF  [CAP-0402-RF]  (hidden comment: 1.5 PF;200V;.05PF;HIGH Q;SMT;CERAMIC;0402)
C547  value 1.5pF  [CAP-0402-RF]  (hidden comment: 1.5 PF;200V;.05PF;HIGH Q;SMT;CERAMIC;0402)
C548  value 0.6pF  [CAP-0402-RF]  (hidden comment: .6 PF;200V;.05PF;HIGH Q;SMT;CERAMIC;0402)
C549  value 27pF  [CAP-0402-N]  (hidden comment: 27 PF;5%;COG;>50V;CHIP;0402)
C550  value 27pF  [CAP-0402-N]  (hidden comment: 27 PF;5%;COG;>50V;CHIP;0402)
C551  value 0.1uF  [CAP-0402-N]  (hidden comment: .1 UF,10%;X7R;16V,CHIP;0402)
C552  value 0.6pF  [CAP-0402-RF]  (hidden comment: .6 PF;200V;.05PF;HIGH Q;SMT;CERAMIC;0402)
C553  value 0.1uF  [CAP-0402-N]  (hidden comment: .1 UF,10%;X7R;16V,CHIP;0402)
C554  value 27pF  [CAP-0402-N]  (hidden comment: 27 PF;5%;COG;>50V;CHIP;0402)
C555  value 27pF  [CAP-0402-N]  (hidden comment: 27 PF;5%;COG;>50V;CHIP;0402)
C556  value 100pF  [CAP-0402-N]  (hidden comment: 100 PF;5%;COG;>50V;CHIP;0402)
C557  value 0.5pF  [CAP-0402-RF]  (hidden comment: .5 PF;200V;.05PF;HIGH Q;SMT;CERAMIC;0402)
C558  value 0.1uF  [CAP-0402-N]  (hidden comment: .1 UF,10%;X7R;16V,CHIP;0402)
C559  value 27pF  [CAP-0402-N]  (hidden comment: 27 PF;5%;COG;>50V;CHIP;0402)
C560  value 27pF  [CAP-0402-N]  (hidden comment: 27 PF;5%;COG;>50V;CHIP;0402)
C561  value 0.5pF  [CAP-0402-RF]  (hidden comment: .5 PF;200V;.05PF;HIGH Q;SMT;CERAMIC;0402)
C562  value 1.5pF  [CAP-0402-RF]  (hidden comment: 1.5 PF;200V;.05PF;HIGH Q;SMT;CERAMIC;0402)
C563  value 1uF  [CAP-0402-N]  (hidden comment: 1UF;10%;X5R;16V;CHIP CERAMIC;0402)
C564  value 100pF  [CAP-0402-N]  (hidden comment: 100 PF;5%;COG;>50V;CHIP;0402)
C565  value 1.5pF  [CAP-0402-RF]  (hidden comment: 1.5 PF;200V;.05PF;HIGH Q;SMT;CERAMIC;0402)
C566  value 0.1uF  [CAP-0402-N]  (hidden comment: .1 UF,10%;X7R;16V,CHIP;0402)
C567  value 1.5pF  [CAP-0402-RF]  (hidden comment: 1.5 PF;200V;.05PF;HIGH Q;SMT;CERAMIC;0402)
C568  value 27pF  [CAP-0402-N]  (hidden comment: 27 PF;5%;COG;>50V;CHIP;0402)
C569  value 27pF  [CAP-0402-N]  (hidden comment: 27 PF;5%;COG;>50V;CHIP;0402)
C570  value 1.5pF  [CAP-0402-RF]  (hidden comment: 1.5 PF;200V;.05PF;HIGH Q;SMT;CERAMIC;0402)
C571  value 1.5pF  [CAP-0402-RF]  (hidden comment: 1.5 PF;200V;.05PF;HIGH Q;SMT;CERAMIC;0402)
C799  value 1.5pF  [CAP-0402-RF]  (hidden comment: 1.5 PF;200V;.05PF;HIGH Q;SMT;CERAMIC;0402)
C801  value 1uF  [CAP-0402-N]  (hidden comment: 1UF;10%;X5R;16V;CHIP CERAMIC;0402)
C805  value 100pF  [CAP-0402-N]  (hidden comment: 100 PF;5%;COG;>50V;CHIP;0402)
C807  value 1uF  [CAP-0402-N]  (hidden comment: 1UF;10%;X5R;16V;CHIP CERAMIC;0402)
C819  value 100pF  [CAP-0402-N]  (hidden comment: 100 PF;5%;COG;>50V;CHIP;0402)
C824  value 1uF  [CAP-0402-N]  (hidden comment: 1UF;10%;X5R;16V;CHIP CERAMIC;0402)
C844  value 0.6pF  [CAP-0402-RF]  (hidden comment: .6 PF;200V;.05PF;HIGH Q;SMT;CERAMIC;0402)
C848  value 0.6pF  [CAP-0402-RF]  (hidden comment: .6 PF;200V;.05PF;HIGH Q;SMT;CERAMIC;0402)
C971  value 5.6pF  [CAP-0402-RF]  (hidden comment: 5.6 PF;200V;.1PF;HIGH Q;SMT;CERAMIC;0402)
FL32  M_PN: HFCN-2100D+  [FV1206]  (hidden comment: FILTER;HI PASS;2100MHz;7SEC;FV1206;RoHS)
FL67  value 3.6 GHz BPF  NoLoad: N/L  [3.6_GHz_BPF]  (hidden comment: MICROSTRIP BPF, 3 TO 4.2 GHz)  (net tie, no BOM)
FL68  value 3.6 GHz BPF  NoLoad: N/L  [3.6_GHz_BPF]  (hidden comment: MICROSTRIP BPF, 3 TO 4.2 GHz)  (net tie, no BOM)
FL69  value 6 GHz BPF  NoLoad: N/L  [6_GHz_BPF_2013-09-30]  (no BOM)
FL71  value 6 GHz BPF  NoLoad: N/L  [6_GHz_BPF_2013-09-30_ALT]  (no BOM)
FL72  value 7.2_GHz_BPF  NoLoad: N/L  [7200_MHz_BPF]  (hidden comment: MICROSTRIP BPF, 7.2 GHz)
FL212  Filter EMI 2200PF,1206  [FIL-NFE31P-1206-4P]  (value not drawn)
FL213  Filter EMI 2200PF,1206  [FIL-NFE31P-1206-4P]  (value not drawn)
FL216  Filter EMI 2200PF,1206  [FIL-NFE31P-1206-4P]  (value not drawn)
FL217  Filter EMI 2200PF,1206  [FIL-NFE31P-1206-4P]  (value not drawn)
FL220  2360 MHZ BANDPASS FILTER 220 MHZ BW;3.2X1.3mm;FV1206;4 PIN  [FV1206]  (value not drawn)
FL223  Filter EMI 2200PF,1206  [FIL-NFE31P-1206-4P]  (value not drawn)
FL224  2360 MHZ BANDPASS FILTER 220 MHZ BW;3.2X1.3mm;FV1206;4 PIN  [FV1206]  (value not drawn)
FL225  Filter EMI 2200PF,1206  [FIL-NFE31P-1206-4P]  (value not drawn)
FL226  Filter EMI 2200PF,1206  [FIL-NFE31P-1206-4P]  (value not drawn)
FL227  Filter EMI 2200PF,1206  [FIL-NFE31P-1206-4P]  (value not drawn)
FL228  F/T FILTER;CHIP;2.5 DCR150MA;16V;T LC;25PF;200MHz;0603  [FIL-NFL18ST]  (value not drawn)
FL231  M_PN: LFCN-3000D+  [FV1206]  (hidden comment: LTER;LOW PASS;3.000GHZ;7 SECTIONS;.5A;1206)
FL232  Filter EMI 2200PF,1206  [FIL-NFE31P-1206-4P]  (value not drawn)
FL258  Filter EMI 2200PF,1206  [FIL-NFE31P-1206-4P]  (value not drawn)
FL259  Filter EMI 2200PF,1206  [FIL-NFE31P-1206-4P]  (value not drawn)
FL260  F/T FILTER;CHIP;2.5 DCR150MA;16V;T LC;25PF;200MHz;0603  [FIL-NFL18ST]  (value not drawn)
FL265  Filter EMI 2200PF,1206  [FIL-NFE31P-1206-4P]  (value not drawn)
FL266  F/T FILTER;CHIP;2.5 DCR150MA;16V;T LC;25PF;200MHz;0603  [FIL-NFL18ST]  (value not drawn)
FL267  M_PN: LFCN-2500+  [FV1206]  (hidden comment: FILTER;LOW PASS;2.500GHZ;5 SECTIONS;1A;1206)
FL268  M_PN: LFCN-2500+  [FV1206]  (hidden comment: FILTER;LOW PASS;2.500GHZ;5 SECTIONS;1A;1206)
FL274  Filter EMI 2200PF,1206  [FIL-NFE31P-1206-4P]  (value not drawn)
FL275  Filter EMI 2200PF,1206  [FIL-NFE31P-1206-4P]  (value not drawn)
FL276  F/T FILTER;CHIP;2.5 DCR150MA;16V;T LC;25PF;200MHz;0603  [FIL-NFL18ST]  (value not drawn)
FL277  M_PN: HFCN-6010+  [FV1206-1]  (hidden comment: FILTER;HI PASS;6010MHz;5SEC;FV1206;RoHS)
FL278  M_PN: HFCN-6010+  [FV1206-1]  (hidden comment: FILTER;HI PASS;6010MHz;5SEC;FV1206;RoHS)
FL279  Filter EMI 2200PF,1206  [FIL-NFE31P-1206-4P]  (value not drawn)
FL280  Filter EMI 2200PF,1206  [FIL-NFE31P-1206-4P]  (value not drawn)
FL281  Filter EMI 2200PF,1206  [FIL-NFE31P-1206-4P]  (value not drawn)
FL282  M_PN: HFCN-2100D+  [FV1206]  (hidden comment: FILTER;HI PASS;2100MHz;7SEC;FV1206;RoHS)
FL283  M_PN: LFCN-113+  [FV1206-4]  (hidden comment: TER;LOW PASS;11.000GHZ;7 SECTIONS;.5A;FV1206-4)
FL285  M_PN: HFCN-4400D+  [FV1206-1]  (hidden comment: FILTER;HI PASS;4400MHz;5SEC;FV1206-1;RoHS)
FL286  FILTER;LOW PASS;5.85GHZ;7 SECTIONS;FV1206  [FV1206]  (value not drawn)
FL287  Filter EMI 2200PF,1206  [FIL-NFE31P-1206-4P]  (value not drawn)
FL288  Filter EMI 2200PF,1206  [FIL-NFE31P-1206-4P]  (value not drawn)
FL289  M_PN: HFCN-4400D+  [FV1206-1]  (hidden comment: FILTER;HI PASS;4400MHz;5SEC;FV1206-1;RoHS)
FL290  FILTER;LOW PASS;5.85GHZ;7 SECTIONS;FV1206  [FV1206]  (value not drawn)
FL291  FILTER;LOW PASS;5.85GHZ;7 SECTIONS;FV1206  [FV1206]  (value not drawn)
FL292  Filter EMI 2200PF,1206  [FIL-NFE31P-1206-4P]  (value not drawn)
FL293  Filter EMI 2200PF,1206  [FIL-NFE31P-1206-4P]  (value not drawn)
FL296  M_PN: LFCN-3800D+  [FV1206]  (hidden comment: FILTER;LOW PASS;3900MHz;7SEC;RoHS;FV1206)
FL297  M_PN: LFCN-3800D+  [FV1206]  (hidden comment: FILTER;LOW PASS;3900MHz;7SEC;RoHS;FV1206)
FT14  Modulation  NoLoad: N/L  [FromToNode_ML2]  (net tie, no BOM)
FT30  Modulation  NoLoad: N/L  [FromToNode_ML5]  (net tie, no BOM)
J16  SMPM FD MALE,STRAIGHT SMT, R/A COPLANAR, 4 PIN THRU-HOLE  [JRSM-70101]
J18  3600 Mod to A1A1  [JRSM-60101]
J19  NoLoad: N/L  [JRSM-40101]  (hidden comment: SMPM;SB;MALE;STRAIGHT;SMT;.152X.152X.150;PCB;R/A CONTACT)
J21  SMPM;FD;MALE;STRAIGHT;SMT;.152X.152X.150;PCB;R/A CONTACT  [JRSM-80100]  (value not drawn)
J22  SMPM FD MALE,STRAIGHT SMT, R/A COPLANAR, 4 PIN THRU-HOLE  [JRSM-70101]  (value not drawn)
L51  value 27nH  [IND-0603HP]  (hidden comment: INDUCTOR;27NH;2%;2.8G SRF;74Q @0.9G;.150DCR;.78A;0603)
L122  value 15nH  [IND-0402HP]  (hidden comment: INDUCTOR;15NH;2%;3.9GHZ SRF;85Q @1.7GHZ;.078 DCR;1.1A;0402)
L123  value 27nH  [IND-0603HP]  (hidden comment: INDUCTOR;27NH;2%;2.8G SRF;74Q @0.9G;.150DCR;.78A;0603)
L125  value 27nH  [IND-0603HP]  (hidden comment: INDUCTOR;27NH;2%;2.8G SRF;74Q @0.9G;.150DCR;.78A;0603)
L127  value 7.5nH  [IND-0402HP]  (hidden comment: INDUCTOR;7.5NH;2%;5.4GHZ SRF;82Q @1.7GHZ;.080 DCR;1.4A;0402)
L128  value 3.9nH  [IND-0402HP]  (hidden comment: INDUCTOR;3.9NH;2%;9.5GHZ SRF;98Q @1.7GHZ;.045 DCR;1.7A;0402)
L168  value 7.5nH  [IND-0402HP]  (hidden comment: INDUCTOR;7.5NH;2%;5.4GHZ SRF;82Q @1.7GHZ;.080 DCR;1.4A;0402)
L169  value 7.5nH  [IND-0402HP]  (hidden comment: INDUCTOR;7.5NH;2%;5.4GHZ SRF;82Q @1.7GHZ;.080 DCR;1.4A;0402)
L170  value 7.5nH  [IND-0402HP]  (hidden comment: INDUCTOR;7.5NH;2%;5.4GHZ SRF;82Q @1.7GHZ;.080 DCR;1.4A;0402)
L184  value 3.9nH  [IND-0402HP]  (hidden comment: INDUCTOR;3.9NH;2%;9.5GHZ SRF;98Q @1.7GHZ;.045 DCR;1.7A;0402)
L185  value 7.5nH  [IND-0402HP]  (hidden comment: INDUCTOR;7.5NH;2%;5.4GHZ SRF;82Q @1.7GHZ;.080 DCR;1.4A;0402)
L186  value 5.6nH  [IND-0402HP]  (hidden comment: INDUCTOR;5.6NH;2%;6.6GHZ SRF;105Q @1.7GHZ;.048 DCR;1.6A;0402)
L187  value 5.6nH  [IND-0402HP]  (hidden comment: INDUCTOR;5.6NH;2%;6.6GHZ SRF;105Q @1.7GHZ;.048 DCR;1.6A;0402)
L188  [U/C ONLY]  value 5.6nH  [IND-0402HP]
L188DC  [D/C ONLY]  NoLoad: N/L  [TLW0-01220_A1-2]
L189  value 15nH  [IND-0402HP]  (hidden comment: INDUCTOR;15NH;2%;3.9GHZ SRF;85Q @1.7GHZ;.078 DCR;1.1A;0402)
L190  [U/C ONLY]  value 15nH  NoLoad: .  [IND-0402HP]
L190DC  [D/C ONLY]  NoLoad: N/L  [TLW0-01220_A1-1]
L191  value 15nH  [IND-0402HP]  (hidden comment: INDUCTOR;15NH;2%;3.9GHZ SRF;85Q @1.7GHZ;.078 DCR;1.1A;0402)
L192  value 15nH  [IND-0402HP]  (hidden comment: INDUCTOR;15NH;2%;3.9GHZ SRF;85Q @1.7GHZ;.078 DCR;1.1A;0402)
L193  value 7.5nH  [IND-0402HP]  (hidden comment: INDUCTOR;7.5NH;2%;5.4GHZ SRF;82Q @1.7GHZ;.080 DCR;1.4A;0402)
L194  value 3.9nH  [IND-0402HP]  (hidden comment: INDUCTOR;3.9NH;2%;9.5GHZ SRF;98Q @1.7GHZ;.045 DCR;1.7A;0402)
L195  value 7.5nH  [IND-0402HP]  (hidden comment: INDUCTOR;7.5NH;2%;5.4GHZ SRF;82Q @1.7GHZ;.080 DCR;1.4A;0402)
L196  value 7.5nH  [IND-0402HP]  (hidden comment: INDUCTOR;7.5NH;2%;5.4GHZ SRF;82Q @1.7GHZ;.080 DCR;1.4A;0402)
L197  value 3.9nH  [IND-0402HP]  (hidden comment: INDUCTOR;3.9NH;2%;9.5GHZ SRF;98Q @1.7GHZ;.045 DCR;1.7A;0402)
L198  value 3.9nH  [IND-0402HP]  (hidden comment: INDUCTOR;3.9NH;2%;9.5GHZ SRF;98Q @1.7GHZ;.045 DCR;1.7A;0402)
L199  value 3.9nH  [IND-0402HP]  (hidden comment: INDUCTOR;3.9NH;2%;9.5GHZ SRF;98Q @1.7GHZ;.045 DCR;1.7A;0402)
L200  value 3.9nH  [IND-0402HP]  (hidden comment: INDUCTOR;3.9NH;2%;9.5GHZ SRF;98Q @1.7GHZ;.045 DCR;1.7A;0402)
L201  value 7.5nH  [IND-0402HP]  (hidden comment: INDUCTOR;7.5NH;2%;5.4GHZ SRF;82Q @1.7GHZ;.080 DCR;1.4A;0402)
L202  value 7.5nH  [IND-0402HP]  (hidden comment: INDUCTOR;7.5NH;2%;5.4GHZ SRF;82Q @1.7GHZ;.080 DCR;1.4A;0402)
L203  value 7.5nH  [IND-0402HP]  (hidden comment: INDUCTOR;7.5NH;2%;5.4GHZ SRF;82Q @1.7GHZ;.080 DCR;1.4A;0402)
L254  value 3.9nH  [IND-0402HP]  (hidden comment: INDUCTOR;3.9NH;2%;9.5GHZ SRF;98Q @1.7GHZ;.045 DCR;1.7A;0402)
MTG32  NoLoad: N/L  [MHP200X92]
MTG33  NoLoad: N/L  [MHP200X92]
MTG36  NoLoad: N/L  [MHP200X92]
MTG37  NoLoad: N/L  [MHP200X92]
MTG45  NoLoad: N/L  [MHP200X92]
MTG75  NoLoad: N/L  [MHP200X92]
MTG86  NoLoad: N/L  [MHP200X92]
MTG87  NoLoad: N/L  [MHP200X92]
MTG89  NoLoad: N/L  [MHP200X92]
MTG90  NoLoad: N/L  [MHP200X92]
MTG91  NoLoad: N/L  [MHP200X92]
MTG92  NoLoad: N/L  [MHP200X92]
MTG93  NoLoad: N/L  [MHP200X92]
MTG147  NoLoad: N/L  [MHP200X92]
MTG148  NoLoad: N/L  [MHP200X92]
MTG149  NoLoad: N/L  [MHP200X92]
MTG150  NoLoad: N/L  [MHP200X92]
MTG151  NoLoad: N/L  [MHP200X92]
MTG152  NoLoad: N/L  [MHP200X92]
MTG153  NoLoad: N/L  [MHP200X92]
MTG154  NoLoad: N/L  [MHP200X92]
MTG155  NoLoad: N/L  [MHP200X92]
MTG156  NoLoad: N/L  [MHP200X92]
MTG157  NoLoad: N/L  [MHP200X92]
MTG158  NoLoad: N/L  [MHP200X92]
MTG159  NoLoad: N/L  [MHP200X92]
MTG160  NoLoad: N/L  [MHP200X92]
MTG161  NoLoad: N/L  [MHP200X92]
MTG162  NoLoad: N/L  [MHP200X92]
MTG163  NoLoad: N/L  [MHP200X92]
MTG164  NoLoad: N/L  [MHP200X92]
MTG165  NoLoad: N/L  [MHP200X92]
MTG166  NoLoad: N/L  [MHP200X92]
MTG167  NoLoad: N/L  [MHP200X92]
MTG168  NoLoad: N/L  [MHP200X92]
MTG169  NoLoad: N/L  [MHP200X92]
MTG170  NoLoad: N/L  [MHP200X92]
MTG171  NoLoad: N/L  [MHP200X92]
MTG172  NoLoad: N/L  [MHP200X92]
MTG178  NoLoad: N/L  [MHP200X92]
MTG179  NoLoad: N/L  [MHP200X92]
MTG180  NoLoad: N/L  [MHP200X92]
MTG181  NoLoad: N/L  [MHP200X92]
MTG182  NoLoad: N/L  [MHP200X92]
MTG183  NoLoad: N/L  [MHP200X92]
MTG184  NoLoad: N/L  [MHP200X92]
MTG185  NoLoad: N/L  [MHP200X92]
MTG186  NoLoad: N/L  [MHP200X92]
MTG187  NoLoad: N/L  [MHP200X92]
MTG188  NoLoad: N/L  [MHP200X92]
MTG189  NoLoad: N/L  [MHP200X92]
MTG190  NoLoad: N/L  [MHP200X92]
MTG191  NoLoad: N/L  [MHP200X92]
MTG200  NoLoad: N/L  [MHP200X92]
R17  value 49.9  [RES-0402-N]  (hidden comment: 49.9 OHMS;.06W;1%;200PPM;FILM;CHIP;0402)
R20  value 49.9  [RES-0402-N]  (hidden comment: 49.9 OHMS;.06W;1%;200PPM;FILM;CHIP;0402)
R22  value 49.9  [RES-0402-N]  (hidden comment: 49.9 OHMS;.06W;1%;200PPM;FILM;CHIP;0402)
R23  value 49.9  [RES-0402-N]  (hidden comment: 49.9 OHMS;.06W;1%;200PPM;FILM;CHIP;0402)
R252  value 39.2  [RES-2010-N]  (hidden comment: 39.2 OHM;.75W;1%;100PPM;FILM CHIP;2010)
R255  value 121  [RES-0402-N]  (hidden comment: 121 OHMS; 1%; .1W; 100PPM; FILM; CHIP; 0402)
R258  value 121  [RES-0402-N]  (hidden comment: 121 OHMS; 1%; .1W; 100PPM; FILM; CHIP; 0402)
R259  value 39.2  [RES-2010-N]  (hidden comment: 39.2 OHM;.75W;1%;100PPM;FILM CHIP;2010)
R389  value 39.2  [RES-2010-N]  (hidden comment: 39.2 OHM;.75W;1%;100PPM;FILM CHIP;2010)
R391  value 1.00K  [RES-0402-N]  (hidden comment: 1.0K OHMS;.06W;1%;200PPM;FILM;CHIP;0402)
R392  value 1.00K  [RES-0402-N]  (hidden comment: 1.0K OHMS;.06W;1%;200PPM;FILM;CHIP;0402)
R396  value 301  [RES-0402-N]  (hidden comment: 301 OHMS; 1%; .1W; 100PPM; FILM; CHIP; 0402)
R397  value 301  [RES-0402-N]  (hidden comment: 301 OHMS; 1%; .1W; 100PPM; FILM; CHIP; 0402)
R398  value 1.00K  [RES-0402-N]  (hidden comment: 1.0K OHMS;.06W;1%;200PPM;FILM;CHIP;0402)
R458  value 1.00K  [RES-0402-N]  (hidden comment: 1.0K OHMS;.06W;1%;200PPM;FILM;CHIP;0402)
R459  value 1.00K  [RES-0402-N]  (hidden comment: 1.0K OHMS;.06W;1%;200PPM;FILM;CHIP;0402)
R460  value 1.00K  [RES-0402-N]  (hidden comment: 1.0K OHMS;.06W;1%;200PPM;FILM;CHIP;0402)
R496  value 301  [RES-0402-N]  (hidden comment: 301 OHMS; 1%; .1W; 100PPM; FILM; CHIP; 0402)
R497  value 301  [RES-0402-N]  (hidden comment: 301 OHMS; 1%; .1W; 100PPM; FILM; CHIP; 0402)
U57  AMP;0-6GHZ;20DB;+20DBM;5V;100MA;SOT-89  [SOT-89]  (value not drawn)
U76  SPDT SWITCH,DC-8.0 GHz,GaAs,IL .5 dB, SMT 2mm PDFN-8, RoHS  [SON50P200X200-X100-9N]  (value not drawn)
U85  AMP;5-11GHz;21dB;+19dBm;5V;114mA;LC3  [QFN-16_HITTITE_LC3_036]  (value not drawn)
U90  [U/C ONLY]  NoLoad: .  M_PN: VMMK-2503  [AMP-VMMK-2503]
U90DC  [D/C ONLY]  NoLoad: N/L  [AMP-VMMK-2503]
U92  MMDC-00310  [QFN-12_HITTITE_LC3]
U95  AMP;0-6GHZ;20DB;+20DBM;5V;100MA;SOT-89  [SOT-89]  (value not drawn)
U96  M_PN: HMC849ALP4CE  [QFN-16_HITTITE_LP4CE]  (hidden comment: SWITCH;SPDT;DC-6GHz;50DB ISO;33DBM;3-5V CTRL;QFN-16)
U98  M_PN: VMMK-2503  [AMP-VMMK-2503]  (hidden comment: AMP;1-12GHz;13.5dB;+17dBm;5V;68mA;WLP-0402)
U99  AMP;5-11GHz;21dB;+19dBm;5V;114mA;LC3  [QFN-16_HITTITE_LC3_036]  (value not drawn)
U100  DOUBLER;1250 3000 MHZ IN;15DB CONV LOSS;10-20DBM IN;MS8  [MS8_Hittite]  (value not drawn)
U101  GaAs;MSPDT;NON-REFLECTIVE;SWITCH;DC - 3.5 GHz  [MS8GE]  (value not drawn)
U103  AMP;0-6GHZ;20DB;+20DBM;5V;100MA;SOT-89  [SOT-89]  (value not drawn)
U104  MMDD-00612  [QFN-16_HITTITE_LC3_036]
U105  M_PN: RMK-3-14+  [TT1224]  (hidden comment: FREQ MULTIPLIER X3;OTPUT 6.6-10 GHz;13-17 dBm INPUT;SMT .25X.31X.16;CASE TT1224)
U110  INVERTER;DUAL;1.65-5.5V SUP;2NS TPD;SC70-6  [SOT-363_419B]  (value not drawn)  (parts A,B of 2)
U122  M_PN: VMMK-2503  [AMP-VMMK-2503]  (hidden comment: AMP;1-12GHz;13.5dB;+17dBm;5V;68mA;WLP-0402)
U123  [U/C ONLY]  NoLoad: .  [AMP-VMMK-2503]
U123DC  [D/C ONLY]  NoLoad: N/L  [AMP-VMMK-2503]

### Ports
2400MHz_Mod, 9600_MHz, EXT_3.6GHz, MOD_INVERSION

### Nets
+5V_VCC: C261.2 C479.1 C517.1 C518.2 C544.2 C545.1 C550.2 C551.1 C553.1 C554.2 C558.1 C559.2 C566.1 C569.2 FL212.3(OUT) FL216.3(OUT) FL217.3(OUT) FL232.1(IN) FL280.1(IN) FL287.1(IN) FL293.1(IN) FT14.1
+6V_FETs: C445.1 C448.2 FL223.3(OUT)
+8V_A: C423.1 C424.1 C486.1 C487.1 C491.1 C492.1 FL226.3(OUT) FL259.3(OUT) FL275.3(OUT) FT30.1
GND: AT17.2(GND) AT18.2(GND) AT19.2(GND) AT22.2(GND) AT26.2(GND) AT27.2(GND) AT28.2(GND) AT29.2(GND) AT30.2(GND) AT32.2(GND) AT33.2(GND) AT34.2(GND) AT35.2(GND) AT36.2(GND) AT37.2(GND) AT38.2(GND) AT39.2(GND) AT40.2(GND) AT41.2(GND) AT73.2(GND) AT74.2(GND) C63.1 C166.1 C235.1 C236.1 C238.1 C239.1 C252.1 C257.2 C261.1 C324.1 C349.1 C350.1 C422.2 C423.2 C424.2 C432.1 C445.2 C446.1 C447.1 C448.1 C472.1 C473.1 C474.1 C475.1 C476.1 C477.1 C478.1 C479.2 C480.1 C481.1 C486.2 C487.2 C488.2 C489.1 C490.1 C491.2 C492.2 C493.2 C494.1 C495.1 C510.1 C511.1 C512.1 C514.1 C516.1 C517.2 C518.1 C519.1 C520.1 C521.1 C540.2 C541.1 C542.1 C543.1 C544.1 C545.2 C546.1 C548.1 C549.1 C550.1 C551.2 C552.1 C553.2 C554.1 C555.1 C556.2 C557.1 C558.2 C559.1 C560.1 C561.1 C562.1 C563.2 C564.1 C565.1 C566.2 C567.1 C568.1 C569.1 C799.1 C801.2 C805.2 C807.2 C819.1 C824.2 C844.1 C848.1 FL32.2(GND) FL32.4(GND) FL212.2(GND) FL213.2(GND) FL216.2(GND) FL217.2(GND) FL220.2(GND) FL220.4(GND) FL223.2(GND) FL224.2(GND) FL224.4(GND) FL225.2(GND) FL226.2(GND) FL227.2(GND) FL228.2(GND) FL231.2(GND) FL231.4(GND) FL232.2(GND) FL258.2(GND) FL259.2(GND) FL260.2(GND) FL265.2(GND) FL266.2(GND) FL267.2(GND) FL267.4(GND) FL268.2(GND) FL268.4(GND) FL274.2(GND) FL275.2(GND) FL276.2(GND) FL277.2(GND) FL277.4(GND) FL277.5(GND) FL277.6(GND) FL278.2(GND) FL278.4(GND) FL278.5(GND) FL278.6(GND) FL279.2(GND) FL280.2(GND) FL281.2(GND) FL282.2(GND) FL282.4(GND) FL283.2(GND) FL283.4(GND) FL285.2(GND) FL285.4(GND) FL285.5(GND) FL285.6(GND) FL286.2(OUT) FL286.4(GND) FL287.2(GND) FL288.2(GND) FL289.2(GND) FL289.4(GND) FL289.5(GND) FL289.6(GND) FL290.2(OUT) FL290.4(GND) FL291.2(OUT) FL291.4(GND) FL292.2(GND) FL293.2(GND) FL296.2(GND) FL296.4(GND) FL297.2(GND) FL297.4(GND) J16.2(GND) J18.2(GND) J19.2(GND) J21.2(GND) J22.2(GND) MTG32.MH MTG33.MH MTG36.MH MTG37.MH MTG45.MH MTG75.MH MTG86.MH MTG87.MH MTG89.MH MTG90.MH MTG91.MH MTG92.MH MTG93.MH MTG147.MH MTG148.MH MTG149.MH MTG150.MH MTG151.MH MTG152.MH MTG153.MH MTG154.MH MTG155.MH MTG156.MH MTG157.MH MTG158.MH MTG159.MH MTG160.MH MTG161.MH MTG162.MH MTG163.MH MTG164.MH MTG165.MH MTG166.MH MTG167.MH MTG168.MH MTG169.MH MTG170.MH MTG171.MH MTG172.MH MTG178.MH MTG179.MH MTG180.MH MTG181.MH MTG182.MH MTG183.MH MTG184.MH MTG185.MH MTG186.MH MTG187.MH MTG188.MH MTG189.MH MTG190.MH MTG191.MH MTG200.MH R258.2 U57.2(GND) U57.4 U76.2(NC) U76.3(NC) U76.6(NC) U76.9(GND) U85.1(NC) U85.2(NC) U85.4(NC) U85.5(NC) U85.6(NC) U85.7(NC) U85.8(NC) U85.9(NC) U85.11(NC) U85.12(NC) U85.14(NC) U85.15(NC) U85.17(GND) U90.2(GND) U90DC.2(GND) U92.1(G) U92.3(G) U92.4(G) U92.6(NC) U92.7(G) U92.9(G) U92.10(NC) U92.11(NC) U92.12(NC) U92.13(G) U95.2(GND) U95.4 U96.4(NC) U96.5(EN) U96.6(NC) U96.7(NC) U96.8(NC) U96.10(GND) U96.11(GND) U96.13(NC) U96.14(NC) U96.15(NC) U96.16(NC) U96.17(GND) U98.2(GND) U99.1(NC) U99.2(NC) U99.4(NC) U99.5(NC) U99.6(NC) U99.7(NC) U99.8(NC) U99.9(NC) U99.11(NC) U99.12(NC) U99.14(NC) U99.15(NC) U99.17(GND) U100.1(NC) U100.3(G) U100.4(NC) U100.5(NC) U100.6(G) U100.8(NC) U101.4(N/C) U101.6(GND) U101.7(GND) U101.9(G) U103.2(GND) U103.4 U104.1(NC) U104.3(G) U104.4(NC) U104.5(NC) U104.6(G) U104.8(NC) U104.9(NC) U104.10(NC) U104.11(NC) U104.12(NC) U104.13(NC) U104.15(G) U104.16(NC) U104.17(G) U105.2 U105.3 U105.5 U105.6 U110.2(V-) U122.2(GND) U123.2(GND) U123DC.2(GND)
4.8GHz: R17.2 R20.2 U110.3(IN) U110.6(OUT)
4.8GHz_1: C473.2 L168.1 U101.1(A)
4.8GHz_2: C324.2 L127.1 U76.8(VC1)
7.2GHz: R22.2 R23.2 U110.4(OUT)
7.2GHz_1: C477.2 L170.1 U101.2(B)
7.2GHz_2: C475.2 L169.1 U76.5(VC2)
2400MHz_Mod: FL220.1(IN) ; port 2400MHz_Mod
9600_MHz: U104.2(LO) ; port 9600_MHz
BPF3.6_1_1: FL67.2(OUT) FL296.3(OUT)
BPF3.6_1_2: AT34.1(IN/OUT) FL67.1(IN)
BPF3.6_2_1: AT35.3(IN/OUT) FL68.1(IN)
BPF3.6_2_2: AT41.1(IN/OUT) FL68.2(OUT)
LO_1: C570.2 U92.2(LO)
NetAT17_1: AT17.1(IN/OUT) FL282.3(OUT)
NetAT17_3: AT17.3(IN/OUT) C538.1
NetAT18_1: AT18.1(IN/OUT) J21.1(CNTR)
NetAT18_3: AT18.3(IN/OUT) C343.1
NetAT19_1: AT19.1(IN/OUT) FL220.3(OUT) R255.2
NetAT19_3: AT19.3(IN/OUT) C342.2
NetAT22_1: AT22.1(IN/OUT) U92.8(RF)
NetAT22_3: AT22.3(IN/OUT) FL69.1(IN)
NetAT26_1: AT26.1(IN/OUT) FL224.3(OUT)
NetAT26_3: AT26.3(IN/OUT) C347.2
NetAT27_1: AT27.1(IN/OUT) FL267.3(OUT)
NetAT27_3: AT27.3(IN/OUT) U100.2(IN)
NetAT28_1: AT28.1(IN/OUT) FL290.3(GND)
NetAT28_3: AT28.3(IN/OUT) FL285.1(IN)
NetAT29_1: AT29.1(IN/OUT) FL277.1(IN)
NetAT29_3: AT29.3(IN/OUT) FL278.3(OUT)
NetAT30_1: AT30.1(IN/OUT) J16.1(CNTR)
NetAT30_3: AT30.3(IN/OUT) FL231.1(IN)
NetAT32_1: AT32.1(IN/OUT) J22.1(CNTR)
NetAT32_3: AT32.3(IN/OUT) C497.1
NetAT33_1: AT33.1(IN/OUT) FL72.2(OUT)
NetAT33_3: AT33.3(IN/OUT) U85.3(RF_IN)
NetAT34_3: AT34.3(IN/OUT) FL32.1(IN)
NetAT35_1: AT35.1(IN/OUT) FL297.3(OUT)
NetAT36_1: AT36.1(IN/OUT) FL291.3(GND)
NetAT36_3: AT36.3(IN/OUT) C237.1
NetAT37_1: AT37.1(IN/OUT) U100.7(OUT)
NetAT37_3: AT37.3(IN/OUT) FL290.1(IN)
NetAT38_1: AT38.1(IN/OUT) FL268.3(OUT)
NetAT38_3: AT38.3(IN/OUT) U105.1
NetAT39_1: AT39.1(IN/OUT) FL286.3(GND)
NetAT39_3: AT39.3(IN/OUT) FL289.1(IN)
NetAT40_1: AT40.1(IN/OUT) FL283.3(OUT)
NetAT40_3: AT40.3(IN/OUT) C571.1
NetAT41_3: AT41.3(IN/OUT) FL282.1(IN)
NetAT73_1: AT73.1(IN/OUT) U104.7(IF)
NetAT73_3: AT73.3(IN/OUT) FL296.1(IN)
NetAT74_1: AT74.1(IN/OUT) FL71.2(OUT)
NetAT74_3: AT74.3(IN/OUT) U104.14(RF)
NetC63_2: C63.2 C819.2 C824.1 L185.1 L201.1 U99.16(VDD1)
NetC166_2: C166.2 L125.1 R259.2
NetC235_2: C235.2 L51.2 R252.1
NetC236_2: C236.2 C556.1 C807.1 L128.1 L184.2 U85.13(VDD2)
NetC237_2: C237.2 U76.1(RF1)
NetC238_2: C238.2 L128.2 L194.1
NetC239_2: C239.2 L195.1 L196.2 R398.2 R460.1
NetC252_2: C252.2 L198.2 L199.1 R496.1
NetC257_1: C257.1 C447.2 FL223.1(IN) FL225.3(OUT)
NetC342_1: C342.1 U95.1
NetC343_2: C343.2 L125.2 U95.3
NetC344_1: C344.1 FL267.1(IN)
NetC344_2: C344.2 U101.8(RF2)
NetC345_1: C345.1 U57.1
NetC345_2: C345.2 R255.1 R258.1
NetC346_1: C346.1 FL224.1(IN)
NetC346_2: C346.2 L51.1 U57.3
NetC347_1: C347.1 U103.1
NetC348_1: C348.1 U101.3(RFC)
NetC348_2: C348.2 L123.2 U103.3
NetC349_2: C349.2 L123.1 R389.2
NetC350_2: C350.2 FL258.1(IN) FL260.3(OUT)
NetC422_1: C422.1 FL260.1(IN) R252.2
NetC432_2: C432.2 FL258.3(OUT) FL259.1(IN)
NetC434_1: C434.1 C570.1 U76.7(RFC)
NetC434_2: C434.2 J19.1(CNTR)
NetC446_2: C446.2 FL225.1(IN) U110.5(V+)
NetC472_2: C472.2 C481.2 L127.2 R17.1
NetC474_2: C474.2 L168.2 R20.1
NetC476_2: C476.2 C480.2 L169.2 R22.1
NetC478_2: C478.2 L170.2 R23.1
NetC488_1: C488.1 FL276.1(IN) R259.1
NetC489_2: C489.2 FL226.1(IN) FL227.3(OUT)
NetC490_2: C490.2 FL227.1(IN) FL276.3(OUT)
NetC493_1: C493.1 FL266.1(IN) R389.1
NetC494_2: C494.2 FL265.3(OUT) FL275.1(IN)
NetC495_2: C495.2 FL265.1(IN) FL266.3(OUT)
NetC496_1: C496.1 FL268.1(IN)
NetC496_2: C496.2 U101.5(RF1)
NetC497_2: C497.2 U96.12(RF2)
NetC510_2: C510.2 FL274.1(IN) L186.1 R396.1
NetC511_2: C511.2 FL216.1(IN) FL274.3(OUT)
NetC512_2: C512.2 L186.2 L187.1 R396.2 R397.1
NetC514_2: C514.2 L187.2 L188.1 L188DC.1(B) R397.2
NetC516_2: C516.2 FL213.1(IN) L122.1 R458.1
NetC519_2: C519.2 FL212.1(IN) FL213.3(OUT)
NetC520_2: C520.2 L122.2 L189.1 R458.2 R459.1
NetC521_2: C521.2 L189.2 L190.1 L190DC.1(B) R459.2
NetC535_1: C535.1 FL32.3(OUT)
NetC535_2: C535.2 L190DC.2(A) U123.1(IN) U123DC.3(OUT)
NetC536_1: C536.1 L190.2 U123.3(OUT) U123DC.1(IN)
NetC536_2: C536.2 FL297.1(IN)
NetC538_2: C538.2 U96.9(RF1)
NetC540_1: C540.1 C543.2 L191.1 R391.1 U96.1(Vdd)
NetC541_2: C541.2 L191.2 L192.1 R391.2 R392.1
NetC542_2: C542.2 FL217.1(IN) L192.2 R392.2
NetC546_2: C546.2 FL281.3(OUT) L195.2 R460.2
NetC547_1: C547.1 FL286.1(IN)
NetC547_2: C547.2 L193.1 U98.3(OUT)
NetC548_2: C548.2 L194.2 L197.1
NetC549_2: C549.2 FL279.1(IN) FL280.3(OUT)
NetC552_2: C552.2 C844.2 L197.2 L254.1
NetC555_2: C555.2 FL232.3(OUT) FL281.1(IN)
NetC557_2: C557.2 L199.2 L200.1 R496.2 R497.1
NetC560_2: C560.2 FL287.3(OUT) FL288.1(IN)
NetC561_2: C561.2 FL288.3(OUT) L200.2 R497.2
NetC562_2: C562.2 L193.2 L196.1 R398.1
NetC563_1: C563.1 C564.2 L185.2 U99.13(VDD2)
NetC565_2: C565.2 L202.2 L203.1
NetC567_2: C567.2 FL292.3(OUT) L203.2
NetC568_2: C568.2 FL292.1(IN) FL293.3(OUT)
NetC571_2: C571.2 U76.4(RF2)
NetC799_2: C799.2 L201.2 L202.1
NetC801_1: C801.1 C805.1 L184.1 U85.16(VDD1)
NetC848_2: C848.2 FL279.3(OUT) L254.2
NetC971_1: C971.1 J18.1(CNTR)
NetC971_2: C971.2 U96.3(RFC)
NetFL69_2: FL69.2(OUT) L188DC.2(A) U90.1(IN) U90DC.3(OUT)
NetFL71_1: FL71.1(IN) L188.2 U90.3(OUT) U90DC.1(IN)
NetFL72_1: FL72.1(IN) L198.1 U122.3(OUT)
NetFL228_1: FL228.1(IN) U96.2(Vctl)
NetFL228_3: FL228.3(OUT) ; port EXT_3.6GHz
NetFL231_3: FL231.3(OUT) U92.5(IF)
NetFL277_3: FL277.3(OUT) U122.1(IN)
NetFL278_1: FL278.1(IN) U105.4
NetFL283_1: FL283.1(IN) U85.10(RF_OUT)
NetFL285_3: FL285.3(OUT) U98.1(IN)
NetFL289_3: FL289.3(OUT) U99.3(RF_IN)
NetFL291_1: FL291.1(IN) U99.10(RF_OUT)
NetR527_2: U110.1(IN) ; port MOD_INVERSION

### Layout directives
net class GCPW Clearance: (no net found under the mark), BPF3.6_1_2, BPF3.6_2_1, BPF3.6_2_2, NetAT17_1, NetAT17_3, NetAT18_1, NetAT18_3, NetAT30_1, NetAT30_3, NetAT32_1, NetAT32_3, NetAT33_1, NetAT34_3, NetAT36_1, NetAT36_3, NetAT40_1, NetAT40_3, NetC343_2, NetC345_1, NetC434_2, NetC497_2, NetC538_2, NetC971_1, NetC971_2
net class 30 mil clearance: 2400MHz_Mod, (no net found under the mark), BPF3.6_1_1, NetAT19_1, NetAT22_3, NetAT26_1, NetAT26_3, NetAT27_1, NetAT28_1, NetAT28_3, NetAT29_1, NetAT29_3, NetAT35_1, NetAT37_3, NetAT38_1, NetAT38_3, NetAT39_1, NetAT39_3, NetC237_2, NetC342_1, NetC344_1, NetC344_2, NetC346_1, NetC346_2, NetC347_1, NetC348_2, NetC496_1, NetC496_2, NetC547_1, NetC571_2, NetFL278_1
net class VMMK-2503 GND Gap: 9600_MHz, LO_1, NetAT22_1, NetAT33_3, NetAT73_1, NetAT74_1, NetAT74_3, NetC434_1, NetC535_1, NetC535_2, NetC536_1, NetC536_2, NetC547_2, NetFL69_2, NetFL71_1, NetFL72_1, NetFL231_3, NetFL277_3, NetFL283_1, NetFL285_3, NetFL289_3, NetFL291_1
net class 35 mil ustrip: NetAT27_3, NetAT37_1
net class AVT-51663 GND Gap: NetC345_2
net class 30 mil ustrip: NetAT19_3